# EAGLE board combined-v2 (EAGLE 9.6.2), part 1 of 2
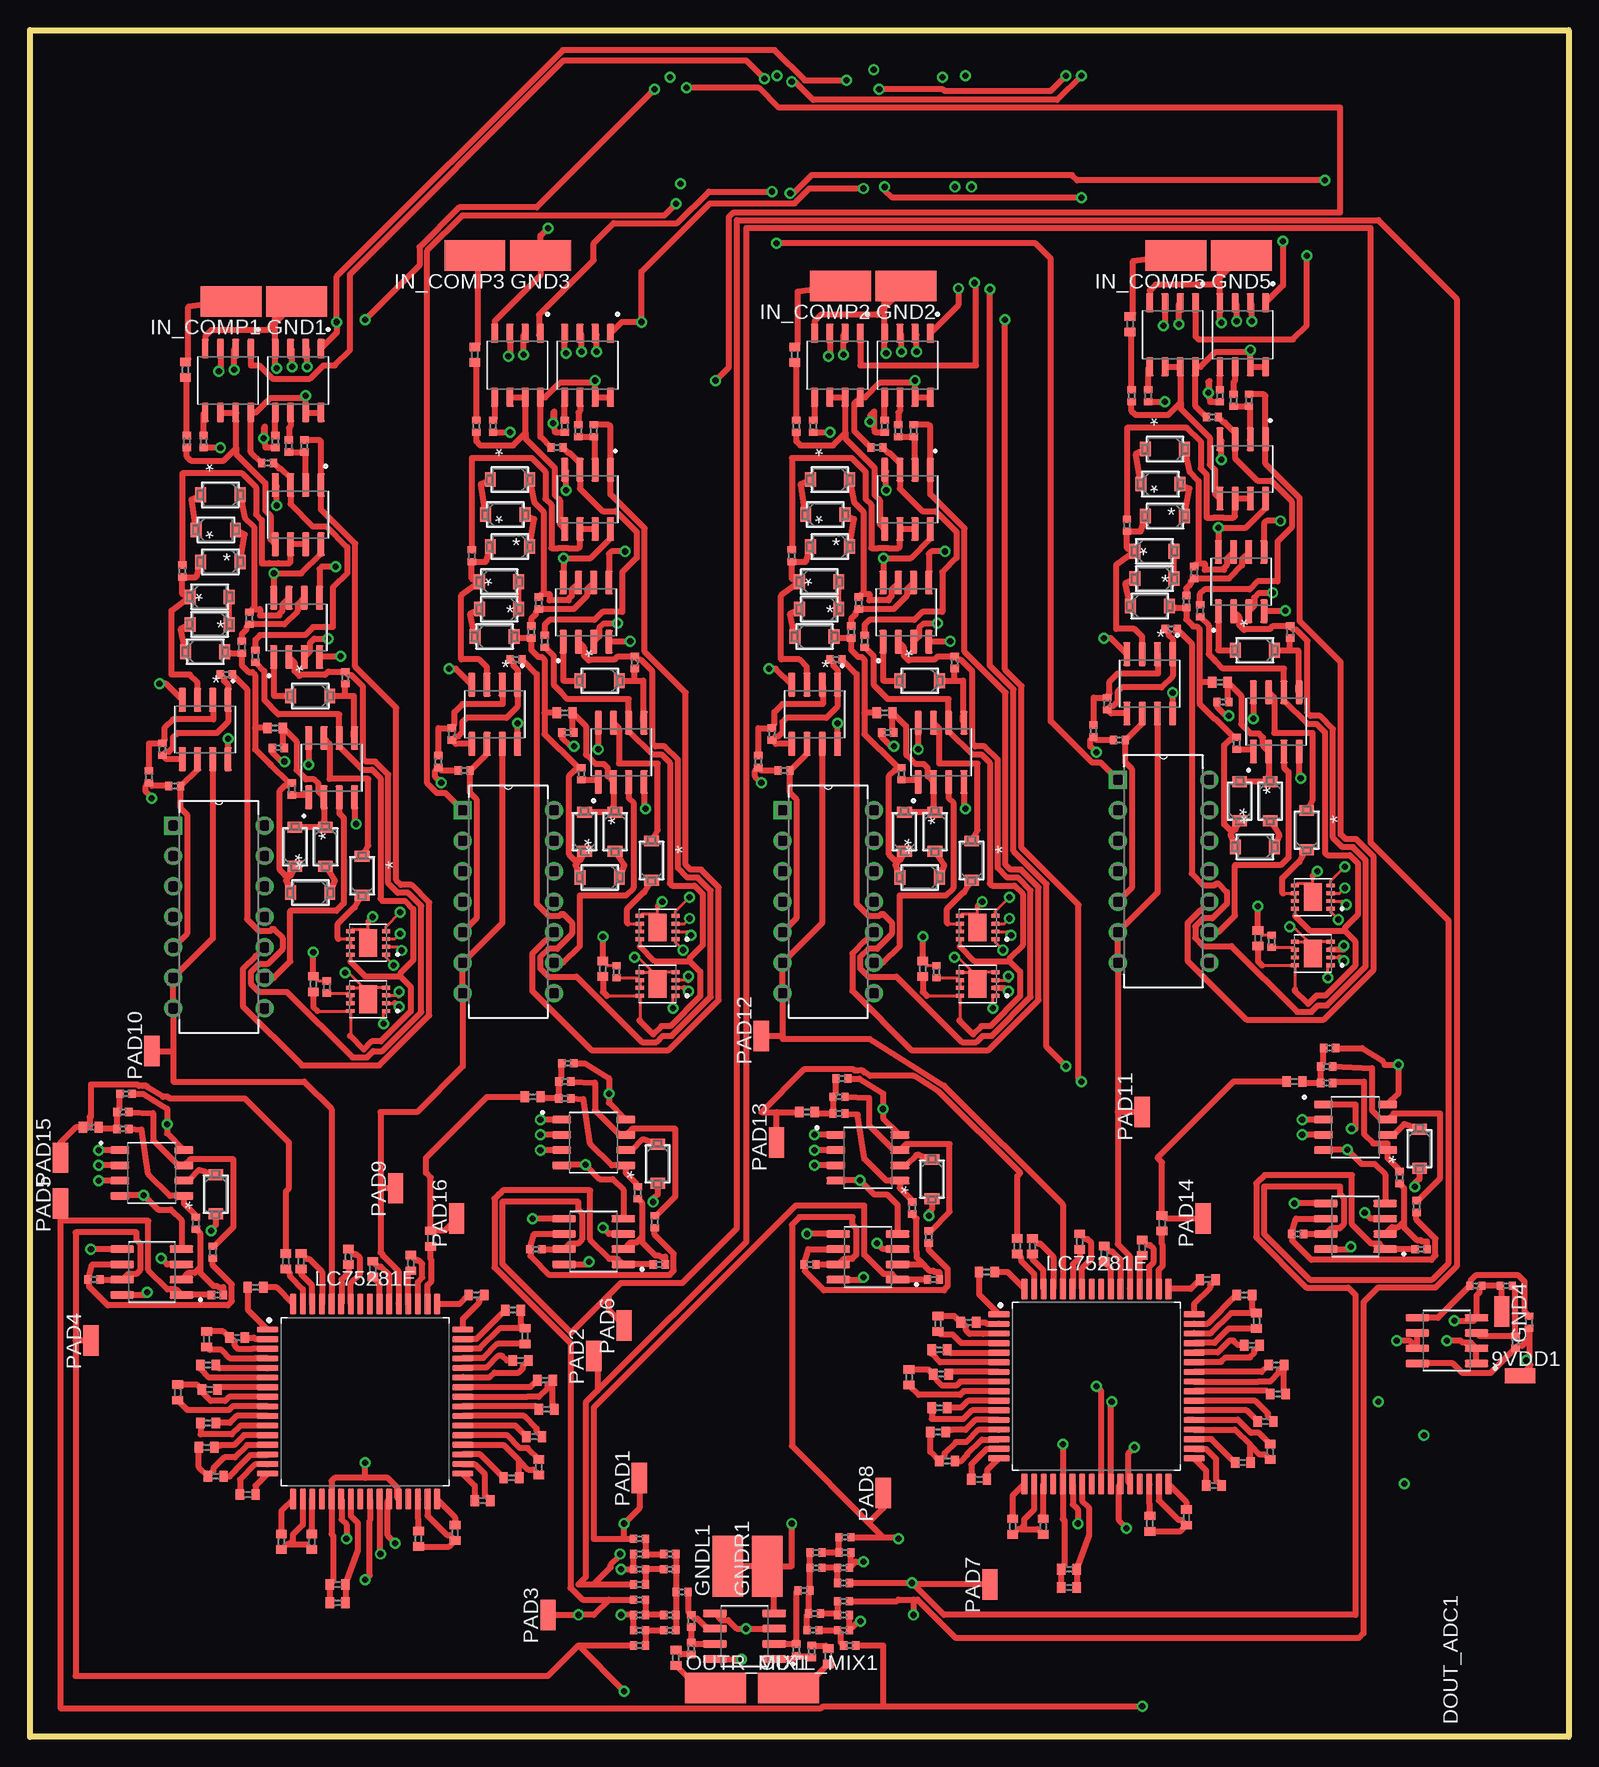
[diagram p6: board, top side]
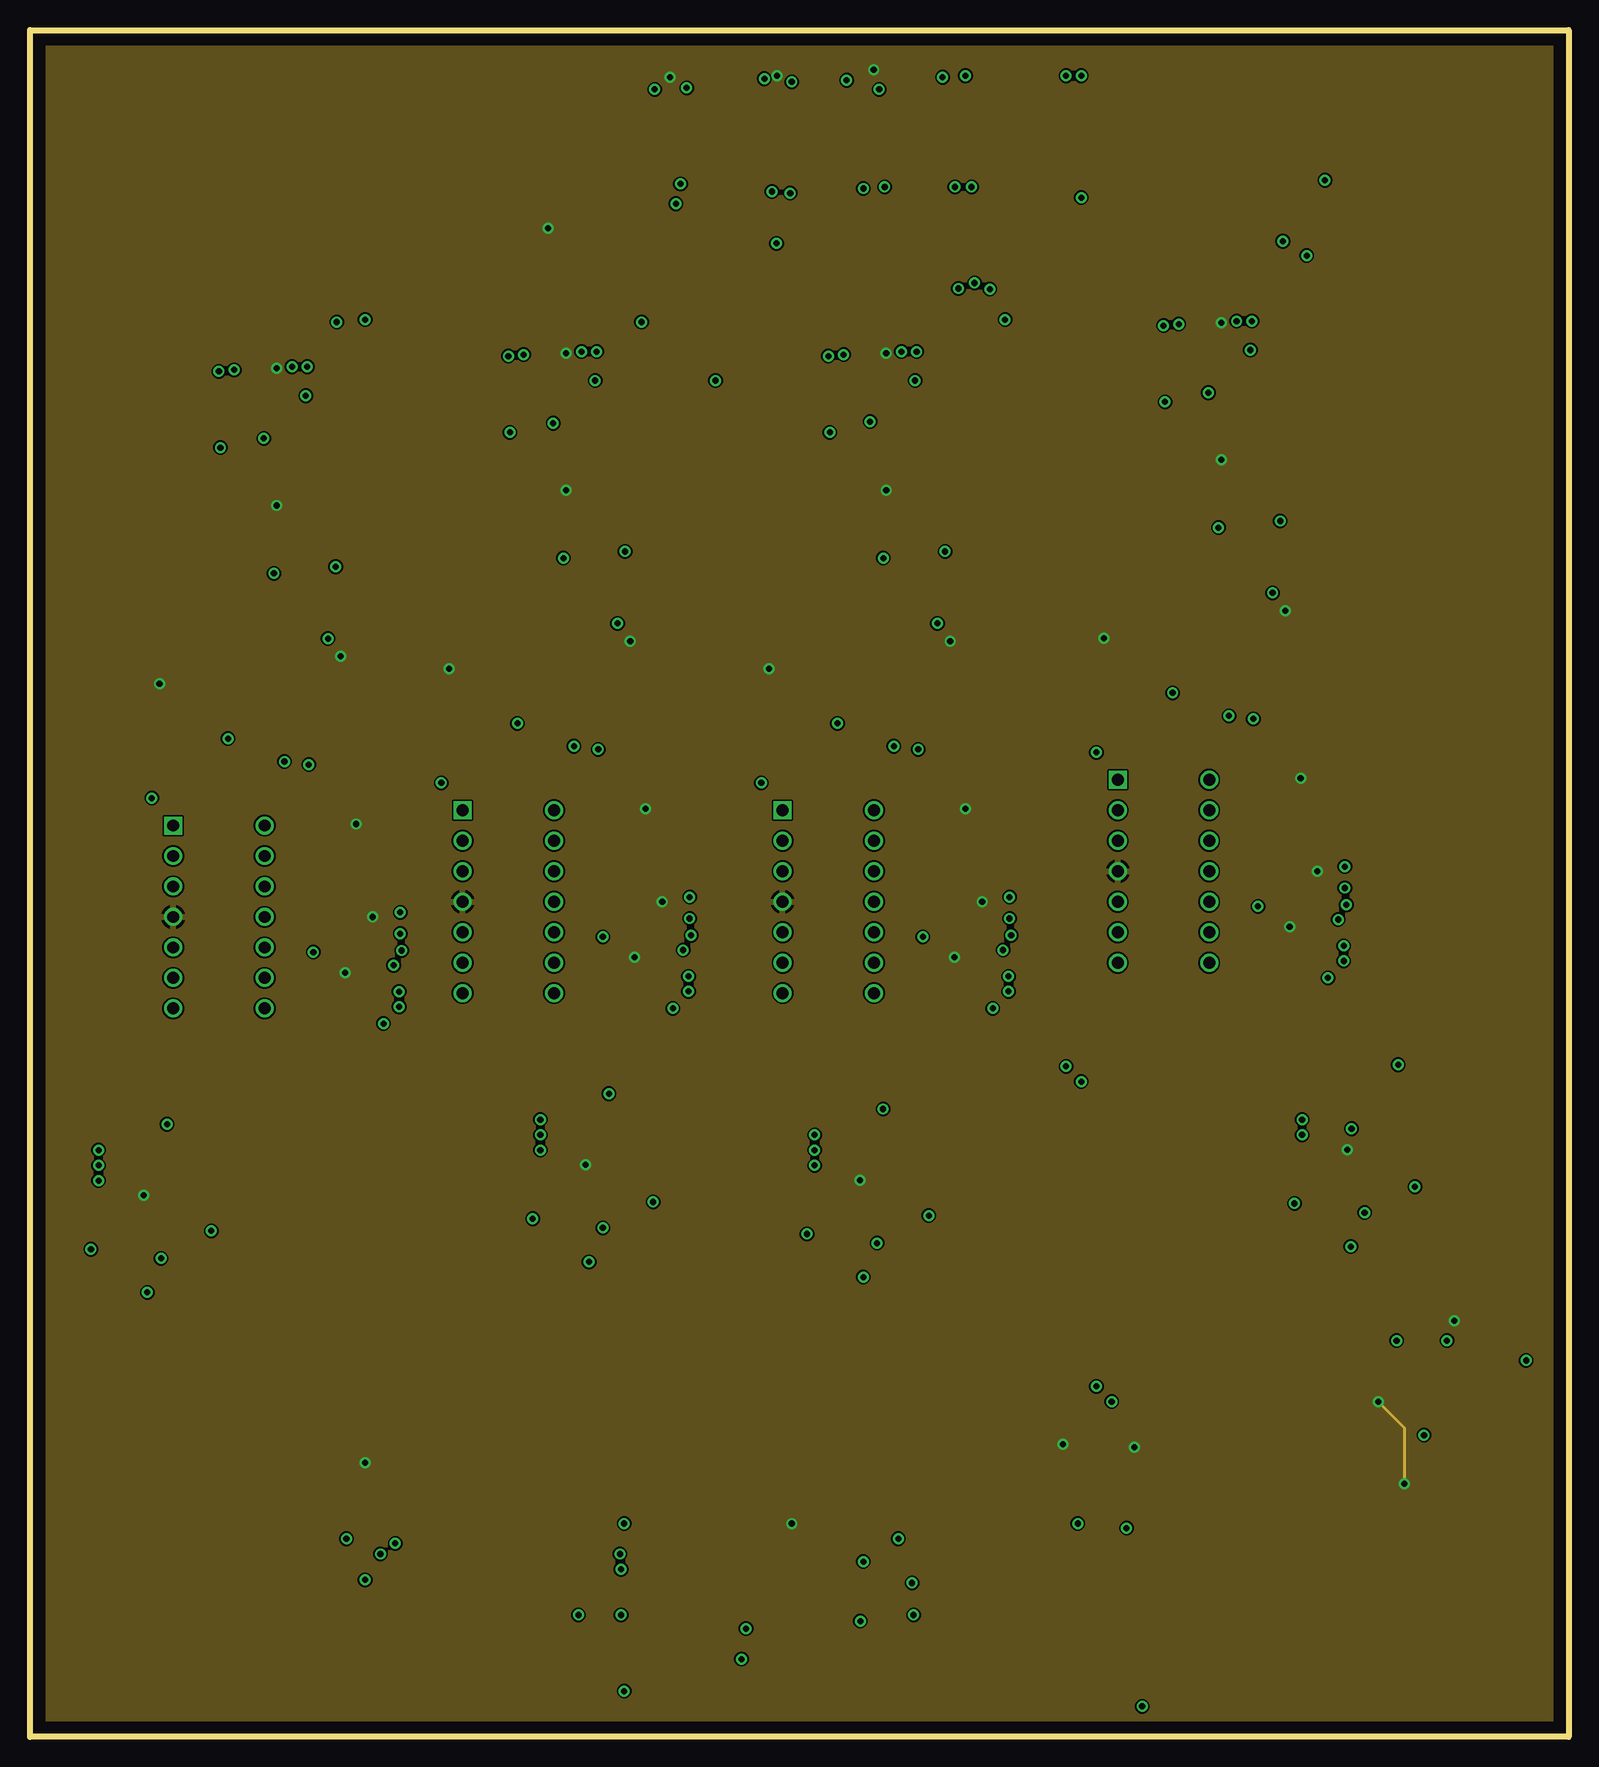
[diagram p7: board, inner layer Route2]
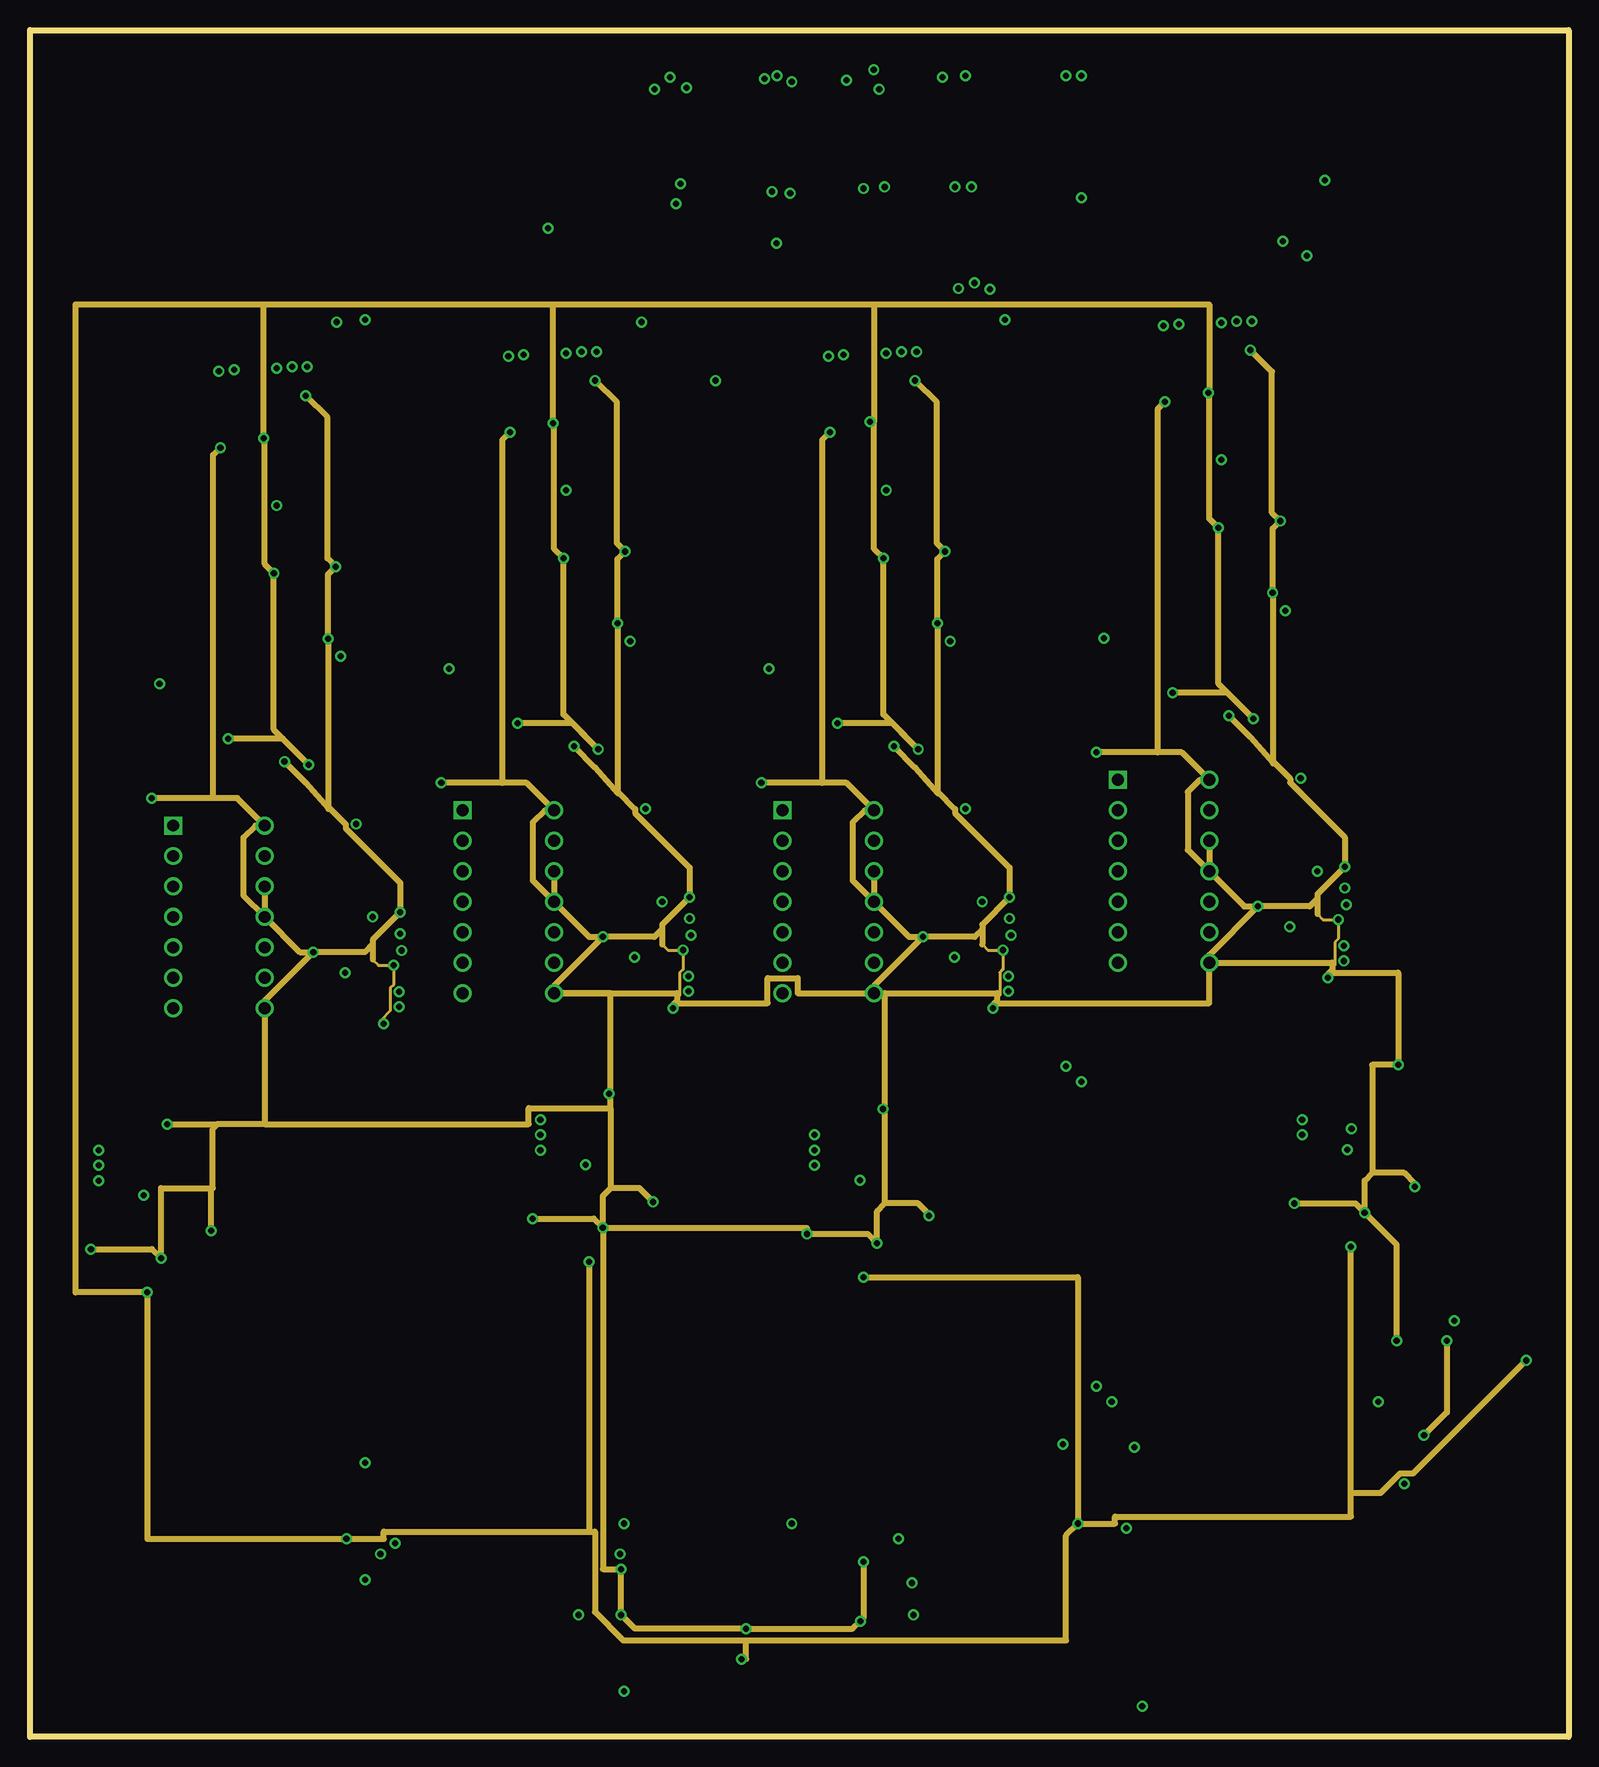
[diagram p8: board, inner layer Route15]
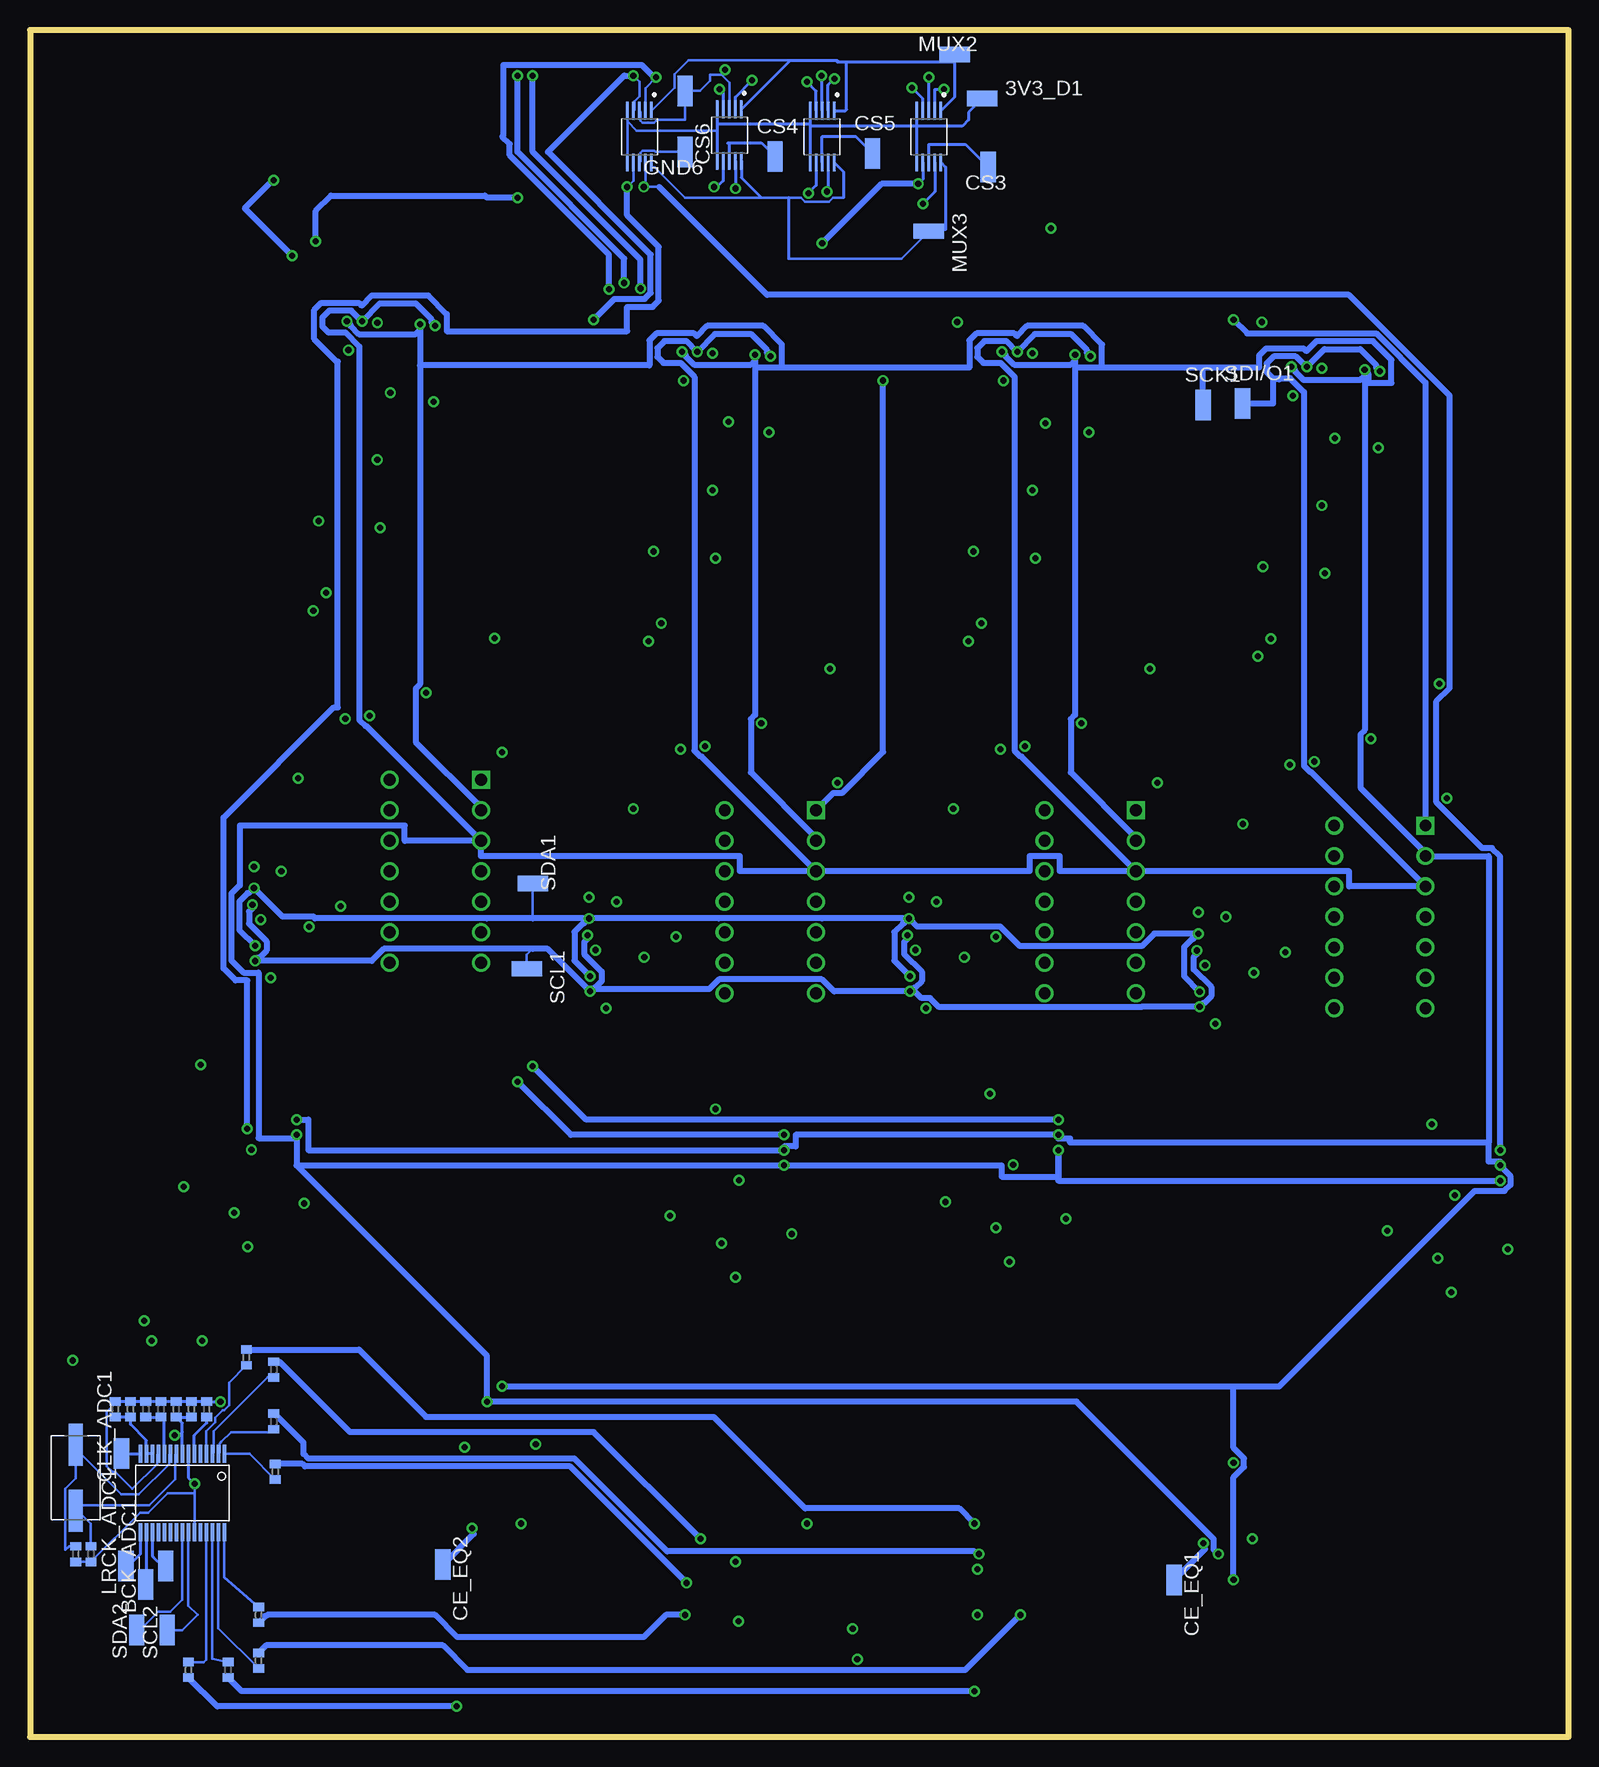
[diagram p9: board, bottom side, seen from below]

Size 128.27 x 142.24 mm. Coordinates in mm from the lower left corner, seen from the top.
Outline: 0,0 0,142.24 128.27,142.24 128.27,0 0,0
Copper layers (1+2*15+16): Top 0.035mm / dielectric 1.5mm / Route2 0.035mm / dielectric 0.15mm / Route15 0.035mm / dielectric 0.2mm / Bottom 0.035mm
Design rules "default *": minimum track width 6mil, minimum drill 0.35mm, track to track 6mil, track to pad 6mil, pad to pad 6mil, via to via 6mil, smd to smd 6mil, copper to edge 40mil, drill to drill 6mil, minimum pad ring 10mil, minimum via ring 8mil, stop-mask expansion 4mil, vias tented up to drill 0mil, thermal gap 10mil

## Footprints (pad centres in the part's own frame; a part is rotated, then mirrored left to right if it is on the bottom)
SMD1,27-2,54 = smd 1.27 x 2.54: 1 0,0
SOIC127P599X175-8N = smd 1.58 x 0.6: 1 -2.67,1.905; 2 -2.67,0.635; 3 -2.67,-0.635; 4 -2.67,-1.905; 5 2.67,-1.905; 6 2.67,-0.635; 7 2.67,0.635; 8 2.67,1.905
DIP254P762X432-14 = drill 0.991 square: 1 -7.62,15.24 | drill 0.991: 2 -7.62,12.7; 3 -7.62,10.16; 4 -7.62,7.62; 5 -7.62,5.08; 6 -7.62,2.54; 7 -7.62,0; 8 0,0; 9 0,2.54; 10 0,5.08; 11 0,7.62; 12 0,10.16; 13 0,12.7; 14 0,15.24
SON65P300X300X80-9N = smd 0.76 x 0.32: 1 -1.485,0.975; 2 -1.485,0.325; 3 -1.485,-0.325; 4 -1.485,-0.975; 5 1.485,-0.975; 6 1.485,-0.325; 7 1.485,0.325; 8 1.485,0.975 | smd 1.5 x 2.3: 9 0,0
C0402 = smd 0.7 x 0.9: 1 -0.65,0; 2 0.65,0
SOD123 = smd 0.91 x 1.22: 1 -1.63,0; 2 1.63,0
SMD2,54-5,08 = smd 2.54 x 5.08: 1 0,0
TSSOP-30 = smd 0.3 x 1.5: 1 -3.5,-3.27; 2 -3,-3.27; 3 -2.5,-3.27; 4 -2,-3.27; 5 -1.5,-3.27; 6 -1,-3.27; 7 -0.5,-3.27; 8 0,-3.27; 9 0.5,-3.27; 10 1,-3.27; 11 1.5,-3.27; 12 2,-3.27; 13 2.5,-3.27; 14 3,-3.27; 15 3.5,-3.27; 16 3.5,3.27; 17 3,3.27; 18 2.5,3.27; 19 2,3.27; 20 1.5,3.27; 21 1,3.27; 22 0.5,3.27; 23 0,3.27; 24 -0.5,3.27; 25 -1,3.27; 26 -1.5,3.27; 27 -2,3.27; 28 -2.5,3.27; 29 -3,3.27; 30 -3.5,3.27
SOIC127P599X175-8N' = smd 1.97 x 0.6: 1 -2.47,1.905; 2 -2.47,0.635; 3 -2.47,-0.635; 4 -2.47,-1.905; 5 2.47,-1.905; 6 2.47,-0.635; 7 2.47,0.635; 8 2.47,1.905
R0402 = smd 0.6 x 0.7: 1 -0.5,0; 2 0.5,0
SOP50P490X110-10N = smd 1.47 x 0.28: 1 -2.15,1; 2 -2.15,0.5; 3 -2.15,0; 4 -2.15,-0.5; 5 -2.15,-1; 6 2.15,-1; 7 2.15,-0.5; 8 2.15,0; 9 2.15,0.5; 10 2.15,1
QFP80P1720X1720X270-64N = smd 1.758 x 0.522: 1 -8.127,6; 2 -8.127,5.2; 3 -8.127,4.4; 4 -8.127,3.6; 5 -8.127,2.8; 6 -8.127,2; 7 -8.127,1.2; 8 -8.127,0.4; 9 -8.127,-0.4; 10 -8.127,-1.2; 11 -8.127,-2; 12 -8.127,-2.8; 13 -8.127,-3.6; 14 -8.127,-4.4; 15 -8.127,-5.2; 16 -8.127,-6; 33 8.127,-6; 34 8.127,-5.2; 35 8.127,-4.4; 36 8.127,-3.6; 37 8.127,-2.8; 38 8.127,-2; 39 8.127,-1.2; 40 8.127,-0.4; 41 8.127,0.4; 42 8.127,1.2; 43 8.127,2; 44 8.127,2.8; 45 8.127,3.6; 46 8.127,4.4; 47 8.127,5.2; 48 8.127,6 | smd 0.522 x 1.758: 17 -6,-8.127; 18 -5.2,-8.127; 19 -4.4,-8.127; 20 -3.6,-8.127; 21 -2.8,-8.127; 22 -2,-8.127; 23 -1.2,-8.127; 24 -0.4,-8.127; 25 0.4,-8.127; 26 1.2,-8.127; 27 2,-8.127; 28 2.8,-8.127; 29 3.6,-8.127; 30 4.4,-8.127; 31 5.2,-8.127; 32 6,-8.127; 49 6,8.127; 50 5.2,8.127; 51 4.4,8.127; 52 3.6,8.127; 53 2.8,8.127; 54 2,8.127; 55 1.2,8.127; 56 0.4,8.127; 57 -0.4,8.127; 58 -1.2,8.127; 59 -2,8.127; 60 -2.8,8.127; 61 -3.6,8.127; 62 -4.4,8.127; 63 -5.2,8.127; 64 -6,8.127
XTAL_ECS-245.7-20-3X-EN-TR = smd 3.5 x 1.2: 1 -2.75,0; 2 2.75,0

## Placement (x,y rotation side)
3V3_D1  [SMD1,27-2,54]  48.89,136.52 270 bottom
9VDD1  [SMD1,27-2,54]  124.21,30.1 270 top
10KPOT1_PAN1  MCP4131-503E/SN  [SOIC127P599X175-8N]  46.99,49.53 0 top
10KPOT1_PAN2  MCP4131-503E/SN  [SOIC127P599X175-8N]  69.85,48.26 0 top
10KPOT1_PAN3  MCP4131-503E/SN  [SOIC127P599X175-8N]  10.16,46.99 0 top
10KPOT1_PAN4  MCP4131-503E/SN  [SOIC127P599X175-8N]  110.49,50.8 0 top
10POT1_COMP1  MCP4131-503E/SN  [SOIC127P599X175-8N]  22.35,113.03 270 top
10POT1_COMP2  MCP4131-503E/SN  [SOIC127P599X175-8N]  73.15,114.3 270 top
10POT1_COMP3  MCP4131-503E/SN  [SOIC127P599X175-8N]  46.48,114.3 270 top
10POT1_COMP5  MCP4131-503E/SN  [SOIC127P599X175-8N]  101.09,116.84 270 top
10POT2_COMP1  MCP4131-503E/SN  [SOIC127P599X175-8N]  16.51,113.03 270 top
10POT2_COMP2  MCP4131-503E/SN  [SOIC127P599X175-8N]  67.31,114.3 270 top
10POT2_COMP3  MCP4131-503E/SN  [SOIC127P599X175-8N]  40.64,114.3 270 top
10POT2_COMP5  MCP4131-503E/SN  [SOIC127P599X175-8N]  95.25,116.84 270 top
100POT1_COMP1  MCP42100-I/P  [DIP254P762X432-14]  19.56,60.71 0 top
100POT1_COMP2  MCP42100-I/P  [DIP254P762X432-14]  70.36,61.98 0 top
100POT1_COMP3  MCP42100-I/P  [DIP254P762X432-14]  43.69,61.98 0 top
100POT1_COMP5  MCP42100-I/P  [DIP254P762X432-14]  98.3,64.52 0 top
200POT1_COMP1  MAX5419NETA+  [SON65P300X300X80-9N]  28.19,66.17 180 top
200POT1_COMP2  MAX5419META+  [SON65P300X300X80-9N]  78.99,67.44 180 top
200POT1_COMP3  MAX5419PETAT  [SON65P300X300X80-9N]  52.32,67.44 180 top
200POT1_COMP5  MAX5419LETA+  [SON65P300X300X80-9N]  106.93,69.98 180 top
200POT2_COMP1  MAX5419NETA+  [SON65P300X300X80-9N]  28.19,61.47 180 top
200POT2_COMP2  MAX5419META+  [SON65P300X300X80-9N]  78.99,62.74 180 top
200POT2_COMP3  MAX5419PETAT  [SON65P300X300X80-9N]  52.32,62.74 180 top
200POT2_COMP5  MAX5419LETA+  [SON65P300X300X80-9N]  106.93,65.28 180 top
BCK_ADC1  [SMD1,27-2,54]  118.62,12.7 0 bottom
C2  10uF  [C0402]  64.77,52.07 0 top
C3  0.1uF  [C0402]  66.55,6.73 270 top
C4  0.1uF  [C0402]  53.85,6.6 270 top
C5  10uF  [C0402]  105.41,54.61 0 top
C6  10uF  [C0402]  41.91,53.34 0 top
C7  0.047uF  [C0402]  18.8,37.46 0 top
C8  10uF  [C0402]  5.08,50.8 0 top
C9  0.047uF  [C0402]  17.27,33.27 180 top
C10  0.01uF  [C0402]  14.86,30.99 0 top
C11  0.01uF  [C0402]  14.99,28.96 180 top
C12  0.068uF  [C0402]  14.86,26.16 0 top
C13  0.068uF  [C0402]  14.73,24.13 180 top
C14  0.01uF  [C0402]  18.16,20.19 180 top
C15  0.01uF  [C0402]  20.96,16.26 270 top
C16  0.01uF  [C0402]  35.43,17.02 270 top
C17  0.01uF  [C0402]  37.72,19.68 0 top
C18  0.068uF  [C0402]  42.42,22.48 270 top
C19  0.068uF  [C0402]  42.04,25.02 0 top
C20  0.01uF  [C0402]  42.93,29.72 0 top
C21  0.01uF  [C0402]  40.89,31.37 180 top
C22  0.047uF  [C0402]  40.26,35.56 0 top
C23  0.047uF  [C0402]  37.21,36.83 180 top
C24  10uF  [C0402]  14.73,33.15 90 top
C25  10uF  [C0402]  12.32,28.7 90 top
C26  10uF  [C0402]  15.49,21.72 180 top
C27  10uF  [C0402]  23.5,16.26 270 top
C28  10uF  [C0402]  25.65,12.7 180 top
C29  10uF  [C0402]  32.39,16.51 270 top
C30  10uF  [C0402]  40.13,21.59 0 top
C31  10uF  [C0402]  43.05,27.3 0 top
C32  10uF  [C0402]  41.28,33.4 90 top
C33  0.1uF  [C0402]  33.4,41.53 90 top
C34  10uF  [C0402]  31.75,39.5 90 top
C35  10uF  [C0402]  28.58,38.99 90 top
C36  10uF  [C0402]  26.54,40.01 90 top
C37  10uF  [C0402]  22.61,39.62 90 top
C38  0.1uF  [C0402]  21.34,39.62 90 top
C39  10uF  [C0402]  25.65,11.18 180 top
C42  680pF  [C0402]  20.45,84.07 0 top
C43  10uF  [C0402]  12.95,113.92 90 top
C44  1.5uF  [C0402]  23.62,62.74 90 top
C45  680pF  [C0402]  71.25,85.34 0 top
C46  10uF  [C0402]  63.75,115.19 90 top
C47  1.5uF  [C0402]  74.42,64.01 90 top
C48  680pF  [C0402]  44.58,85.34 0 top
C49  10uF  [C0402]  37.08,115.19 90 top
C50  1.5uF  [C0402]  47.75,64.01 90 top
C54  680pF  [C0402]  99.19,87.88 0 top
C55  10uF  [C0402]  91.69,117.73 90 top
C56  1.5uF  [C0402]  102.36,66.55 90 top
C68  0.1uF  [C0402]  119.89,27.3 90 bottom
C69  10uF  [C0402]  121.16,27.3 90 bottom
C70  0.1uF  [C0402]  114.81,27.3 90 bottom
C71  10uF  [C0402]  116.08,27.3 90 bottom
C72  1uF  [C0402]  113.54,27.3 90 bottom
C73  0.1uF  [C0402]  117.35,27.3 90 bottom
C74  1uF  [C0402]  118.62,27.3 90 bottom
C75  15pF  [C0402]  123.19,15.24 270 bottom
C76  15pF  [C0402]  124.46,15.24 270 bottom
C77  10uF  [C0402]  107.95,26.29 270 bottom
C78  10uF  [C0402]  110.24,31.62 270 bottom
C79  10uF  [C0402]  109.22,6.35 270 bottom
C80  10uF  [C0402]  115.06,5.59 90 bottom
C81  10uF  [C0402]  107.95,30.61 270 bottom
C82  10uF  [C0402]  109.22,10.16 90 bottom
C83  10uF  [C0402]  111.76,5.59 90 bottom
C84  10uF  [C0402]  107.82,22.1 270 bottom
C103  0.047uF  [C0402]  79.76,38.73 0 top
C104  0.047uF  [C0402]  78.23,34.54 180 top
C105  0.01uF  [C0402]  75.82,32.26 0 top
C106  0.01uF  [C0402]  75.95,30.23 180 top
C107  0.068uF  [C0402]  75.82,27.43 0 top
C108  0.068uF  [C0402]  75.69,25.4 180 top
C109  0.01uF  [C0402]  79.12,21.46 180 top
C110  0.01uF  [C0402]  81.92,17.53 270 top
C111  0.01uF  [C0402]  96.39,18.29 270 top
C112  0.01uF  [C0402]  98.68,20.95 0 top
C113  0.068uF  [C0402]  103.38,23.75 270 top
C114  0.068uF  [C0402]  103,26.29 0 top
C115  0.01uF  [C0402]  103.89,30.99 0 top
C116  0.01uF  [C0402]  101.85,32.64 180 top
C117  0.047uF  [C0402]  101.22,36.83 0 top
C118  0.047uF  [C0402]  98.17,38.1 180 top
C119  10uF  [C0402]  75.69,34.42 90 top
C120  10uF  [C0402]  73.28,29.97 90 top
C121  10uF  [C0402]  76.45,22.99 180 top
C122  10uF  [C0402]  84.45,17.53 270 top
C123  10uF  [C0402]  86.61,13.97 180 top
C124  10uF  [C0402]  93.34,17.78 270 top
C125  10uF  [C0402]  101.09,22.86 0 top
C126  10uF  [C0402]  104.01,28.57 0 top
C127  10uF  [C0402]  102.23,34.67 90 top
C128  0.1uF  [C0402]  94.36,42.8 90 top
C129  10uF  [C0402]  92.71,40.77 90 top
C130  10uF  [C0402]  89.53,40.26 90 top
C131  10uF  [C0402]  87.5,41.27 90 top
C132  10uF  [C0402]  83.57,40.89 90 top
C133  0.1uF  [C0402]  82.3,40.89 90 top
C134  10uF  [C0402]  86.61,12.45 180 top
CE_EQ1  [SMD1,27-2,54]  32.89,13.08 180 bottom
CE_EQ2  [SMD1,27-2,54]  93.85,14.35 180 bottom
CLK_ADC1  [SMD1,27-2,54]  120.65,23.62 0 bottom
CS3  [SMD1,27-2,54]  48.39,130.81 180 bottom
CS4  [SMD1,27-2,54]  66.17,131.7 0 bottom
CS5  [SMD1,27-2,54]  58.04,131.95 0 bottom
CS6  [SMD1,27-2,54]  73.66,132.08 180 bottom
D2  1N4148W-TP  [SOD123]  52.32,47.75 270 top
D3  1N4148W-TP  [SOD123]  75.18,46.48 270 top
D4  1N4148W-TP  [SOD123]  15.49,45.21 270 top
D5  1N4148W-TP  [SOD123]  115.82,49.02 270 top
D16  1N4148W-TP  [SOD123]  24.64,74.17 270 top
D17  1N4148W-TP  [SOD123]  23.37,70.36 180 top
D18  1N4148W-TP  [SOD123]  22.1,74.17 90 top
D19  1N4148W-TP  [SOD123]  27.69,71.75 90 top
D20  1N4148W-TP  [SOD123]  15.88,103.5 180 top
D21  1N4148W-TP  [SOD123]  15.49,100.58 0 top
D22  1N4148W-TP  [SOD123]  15.88,97.92 180 top
D23  1N4148W-TP  [SOD123]  14.99,95 0 top
D24  1N4148W-TP  [SOD123]  14.99,92.71 180 top
D25  1N4148W-TP  [SOD123]  14.61,90.42 0 top
D26  1N4148W-TP  [SOD123]  23.37,86.74 180 top
D27  1N4148W-TP  [SOD123]  75.44,75.44 270 top
D28  1N4148W-TP  [SOD123]  74.17,71.63 180 top
D29  1N4148W-TP  [SOD123]  72.9,75.44 90 top
D30  1N4148W-TP  [SOD123]  78.49,73.03 90 top
D31  1N4148W-TP  [SOD123]  66.68,104.77 180 top
D32  1N4148W-TP  [SOD123]  66.29,101.85 0 top
D33  1N4148W-TP  [SOD123]  66.68,99.19 180 top
D34  1N4148W-TP  [SOD123]  65.79,96.27 0 top
D35  1N4148W-TP  [SOD123]  65.79,93.98 180 top
D36  1N4148W-TP  [SOD123]  65.41,91.69 0 top
D37  1N4148W-TP  [SOD123]  74.17,88.01 180 top
D38  1N4148W-TP  [SOD123]  48.77,75.44 270 top
D39  1N4148W-TP  [SOD123]  47.5,71.63 180 top
D40  1N4148W-TP  [SOD123]  46.23,75.44 90 top
D41  1N4148W-TP  [SOD123]  51.82,73.03 90 top
D42  1N4148W-TP  [SOD123]  40.01,104.77 180 top
D43  1N4148W-TP  [SOD123]  39.62,101.85 0 top
D44  1N4148W-TP  [SOD123]  40.01,99.19 180 top
D45  1N4148W-TP  [SOD123]  39.12,96.27 0 top
D46  1N4148W-TP  [SOD123]  39.12,93.98 180 top
D47  1N4148W-TP  [SOD123]  38.73,91.69 0 top
D48  1N4148W-TP  [SOD123]  47.5,88.01 180 top
D60  1N4148W-TP  [SOD123]  103.38,77.98 270 top
D61  1N4148W-TP  [SOD123]  102.11,74.17 180 top
D62  1N4148W-TP  [SOD123]  100.84,77.98 90 top
D63  1N4148W-TP  [SOD123]  106.43,75.56 90 top
D64  1N4148W-TP  [SOD123]  94.61,107.31 180 top
D65  1N4148W-TP  [SOD123]  94.23,104.39 0 top
D66  1N4148W-TP  [SOD123]  94.61,101.73 180 top
D67  1N4148W-TP  [SOD123]  93.73,98.81 0 top
D68  1N4148W-TP  [SOD123]  93.73,96.52 180 top
D69  1N4148W-TP  [SOD123]  93.34,94.23 0 top
D70  1N4148W-TP  [SOD123]  102.11,90.55 180 top
DOUT_ADC1  [SMD1,27-2,54]  116.97,14.22 0 bottom
GND1  [SMD2,54-5,08]  22.23,119.63 90 top
GND2  [SMD2,54-5,08]  73.03,120.9 90 top
GND3  [SMD2,54-5,08]  42.55,123.44 90 top
GND4  [SMD1,27-2,54]  122.68,35.43 180 top
GND5  [SMD2,54-5,08]  100.97,123.44 90 top
GND6  [SMD1,27-2,54]  73.66,137.16 180 bottom
GNDL1  [SMD2,54-5,08]  58.17,14.22 0 top
GNDR1  [SMD2,54-5,08]  61.47,14.22 0 top
IC2  PCM1865DBT  [TSSOP-30]  115.57,20.32 180 bottom
IN_COMP1  [SMD2,54-5,08]  16.76,119.63 90 top
IN_COMP2  [SMD2,54-5,08]  67.56,120.9 90 top
IN_COMP3  [SMD2,54-5,08]  37.08,123.44 90 top
IN_COMP5  [SMD2,54-5,08]  95.5,123.44 90 top
LRCK_ADC1  [SMD1,27-2,54]  120.27,14.22 0 bottom
MUX2  [SMD1,27-2,54]  51.18,140.21 270 bottom
MUX3  [SMD1,27-2,54]  53.34,125.48 270 bottom
OPAMP1_COMP1  LM4562MAX/NOPB  [SOIC127P599X175-8N']  25.15,80.77 90 top
OPAMP1_COMP2  LM4562MAX/NOPB  [SOIC127P599X175-8N']  75.95,82.04 90 top
OPAMP1_COMP3  LM4562MAX/NOPB  [SOIC127P599X175-8N']  49.28,82.04 90 top
OPAMP1_COMP5  LM4562MAX/NOPB  [SOIC127P599X175-8N']  103.89,84.58 90 top
OPAMP1_MIX1  LM4562MAX/NOPB  [SOIC127P599X175-8N']  59.56,8.38 180 top
OPAMP1_PAN1  LM4562MAX/NOPB  [SOIC127P599X175-8N']  46.99,41.27 180 top
OPAMP1_PAN2  LM4562MAX/NOPB  [SOIC127P599X175-8N']  69.85,40.01 180 top
OPAMP1_PAN3  LM4562MAX/NOPB  [SOIC127P599X175-8N']  10.16,38.73 180 top
OPAMP1_PAN4  LM4562MAX/NOPB  [SOIC127P599X175-8N']  110.49,42.54 180 top
OPAMP2_COMP1  LM4562MAX/NOPB  [SOIC127P599X175-8N']  22.35,101.85 270 top
OPAMP2_COMP2  LM4562MAX/NOPB  [SOIC127P599X175-8N']  73.15,103.12 270 top
OPAMP2_COMP3  LM4562MAX/NOPB  [SOIC127P599X175-8N']  46.48,103.12 270 top
OPAMP2_COMP5  LM4562MAX/NOPB  [SOIC127P599X175-8N']  101.09,105.66 270 top
OPAMP3_COMP1  LM4562MAX/NOPB  [SOIC127P599X175-8N']  22.23,92.46 90 top
OPAMP3_COMP2  LM4562MAX/NOPB  [SOIC127P599X175-8N']  73.03,93.73 90 top
OPAMP3_COMP3  LM4562MAX/NOPB  [SOIC127P599X175-8N']  46.36,93.73 90 top
OPAMP3_COMP5  LM4562MAX/NOPB  [SOIC127P599X175-8N']  100.97,96.27 90 top
OPAMP4_COMP1  LM4562MAX/NOPB  [SOIC127P599X175-8N']  14.61,83.95 270 top
OPAMP4_COMP2  LM4562MAX/NOPB  [SOIC127P599X175-8N']  65.41,85.22 270 top
OPAMP4_COMP3  LM4562MAX/NOPB  [SOIC127P599X175-8N']  38.73,85.22 270 top
OPAMP4_COMP5  LM4562MAX/NOPB  [SOIC127P599X175-8N']  93.34,87.76 270 top
OUTL_MIX1  [SMD2,54-5,08]  63.25,4.06 270 top
OUTR_MIX1  [SMD2,54-5,08]  57.15,4.06 270 top
PAD1  [SMD1,27-2,54]  50.8,21.59 0 top
PAD2  [SMD1,27-2,54]  46.99,31.75 0 top
PAD3  [SMD1,27-2,54]  43.18,10.16 0 top
PAD4  [SMD1,27-2,54]  5.08,33.02 0 top
PAD5  [SMD1,27-2,54]  2.54,44.45 0 top
PAD6  [SMD1,27-2,54]  49.53,34.29 0 top
PAD7  [SMD1,27-2,54]  80.01,12.7 0 top
PAD8  [SMD1,27-2,54]  71.12,20.32 0 top
PAD9  [SMD1,27-2,54]  30.48,45.72 0 top
PAD10  [SMD1,27-2,54]  10.16,57.15 0 top
PAD11  [SMD1,27-2,54]  92.71,52.07 0 top
PAD12  [SMD1,27-2,54]  60.96,58.42 0 top
PAD13  [SMD1,27-2,54]  62.23,49.53 0 top
PAD14  [SMD1,27-2,54]  97.79,43.18 0 top
PAD15  [SMD1,27-2,54]  2.54,48.26 0 top
PAD16  [SMD1,27-2,54]  35.56,43.18 0 top
R5  10k  [R0402]  120.52,37.59 180 top
R6  1M  [R0402]  67.69,54.86 180 top
R7  5k  [R0402]  67.44,53.34 180 top
R8  10k  [R0402]  124.97,34.54 90 top
R9  10k  [R0402]  123.06,37.59 0 top
R10  5k  [R0402]  67.44,51.94 180 top
R11  5k  [R0402]  73.53,44.07 90 top
R12  10k  [R0402]  65.02,39.37 180 top
R13  5k  [R0402]  74.93,41.66 270 top
R14  10k  [R0402]  75.31,38.1 180 top
R15  1M  [R0402]  108.33,57.4 180 top
R16  5k  [R0402]  108.08,55.88 180 top
R17  5k  [R0402]  108.08,54.48 180 top
R18  5k  [R0402]  114.17,46.61 90 top
R19  10k  [R0402]  105.66,41.91 180 top
R20  5k  [R0402]  115.57,44.2 270 top
R21  10k  [R0402]  115.95,40.64 180 top
R22  17k  [R0402]  123.83,32.89 90 top
R31  5k  [R0402]  68.33,7.62 180 top
R32  10k  [R0402]  65.53,15.37 180 top
R33  5k  [R0402]  67.82,11.3 180 top
R34  10k  [R0402]  65.53,14.1 180 top
R35  5k  [R0402]  67.94,15.37 180 top
R36  5k  [R0402]  67.82,14.1 0 top
R37  5k  [R0402]  67.82,10.16 0 top
R38  5k  [R0402]  67.82,8.89 0 top
R39  5k  [R0402]  67.94,16.64 180 top
R40  5k  [R0402]  67.82,12.83 180 top
R41  10k  [R0402]  65.41,10.29 180 top
R42  10k  [R0402]  65.28,8.89 180 top
R43  5k  [R0402]  64.52,12.19 180 top
R44  50k  [R0402]  63.88,7.24 270 top
R45  1k  [R0402]  65.15,7.11 90 top
R46  5k  [R0402]  50.8,16.51 0 top
R47  10k  [R0402]  53.34,8.89 0 top
R48  5k  [R0402]  50.8,12.7 0 top
R49  10k  [R0402]  53.34,10.16 0 top
R50  5k  [R0402]  50.8,8.89 0 top
R51  5k  [R0402]  50.8,10.16 180 top
R52  5k  [R0402]  50.8,13.97 180 top
R53  5k  [R0402]  50.8,15.24 180 top
R54  5k  [R0402]  50.8,7.62 0 top
R55  5k  [R0402]  50.8,11.43 0 top
R56  10k  [R0402]  53.34,13.97 0 top
R57  10k  [R0402]  53.34,15.24 0 top
R58  5k  [R0402]  54.36,12.06 0 top
R59  50k  [R0402]  55.12,9.65 270 top
R60  1k  [R0402]  55.12,7.37 270 top
R63  100k  [R0402]  20.7,82.42 0 top
R64  470k  [R0402]  19.81,106.17 0 top
R65  1k  [R0402]  21.84,78.99 270 top
R66  470k  [R0402]  18.8,90.04 90 top
R67  100k  [R0402]  21.59,107.57 270 top
R68  1M  [R0402]  44.83,56.13 180 top
R69  5k  [R0402]  44.58,54.61 180 top
R70  5k  [R0402]  44.58,53.21 180 top
R71  5k  [R0402]  50.67,45.34 90 top
R72  10k  [R0402]  42.16,40.64 180 top
R73  5k  [R0402]  52.07,42.93 270 top
R74  10k  [R0402]  52.45,39.37 180 top
R75  100k  [R0402]  22.86,107.57 90 top
R76  10k  [R0402]  20.45,107.95 90 top
R77  100k  [R0402]  26.29,88.26 270 top
R78  100k  [R0402]  16.38,88.52 0 top
R79  100k  [R0402]  11.05,82.3 90 top
R80  10k  [R0402]  9.91,80.01 90 top
R81  20k  [R0402]  12.07,79.25 0 top
R82  1M  [R0402]  8,53.59 180 top
R83  5k  [R0402]  7.75,52.07 180 top
R84  5k  [R0402]  7.75,50.67 180 top
R85  5k  [R0402]  13.84,42.8 90 top
R86  10k  [R0402]  5.33,38.1 180 top
R87  5k  [R0402]  15.24,40.39 270 top
R88  10k  [R0402]  15.62,36.83 180 top
R89  100k  [R0402]  17.65,90.8 270 top
R90  100k  [R0402]  18.29,93.22 270 top
R91  100k  [R0402]  13.08,107.95 90 top
R92  10k  [R0402]  14.48,107.95 270 top
R93  100k  [R0402]  12.7,97.16 90 top
R94  100k  [R0402]  24.77,62.48 270 top
R95  100k  [R0402]  71.5,83.69 0 top
R96  470k  [R0402]  70.61,107.44 0 top
R97  1k  [R0402]  72.64,80.26 270 top
R98  470k  [R0402]  69.6,91.31 90 top
R99  100k  [R0402]  72.39,108.84 270 top
R100  100k  [R0402]  73.66,108.84 90 top
R101  10k  [R0402]  71.25,109.22 90 top
R102  100k  [R0402]  77.09,89.53 270 top
R103  100k  [R0402]  67.18,89.79 0 top
R104  100k  [R0402]  61.85,83.57 90 top
R105  10k  [R0402]  60.71,81.28 90 top
R106  20k  [R0402]  62.87,80.52 0 top
R107  100k  [R0402]  68.45,92.07 270 top
R108  100k  [R0402]  69.09,94.49 270 top
R109  100k  [R0402]  63.88,109.22 90 top
R110  10k  [R0402]  65.28,109.22 270 top
R111  100k  [R0402]  63.5,98.42 90 top
R112  100k  [R0402]  75.56,63.75 270 top
R113  100k  [R0402]  44.83,83.69 0 top
R114  470k  [R0402]  43.94,107.44 0 top
R115  1k  [R0402]  45.97,80.26 270 top
R116  470k  [R0402]  42.93,91.31 90 top
R117  100k  [R0402]  45.72,108.84 270 top
R118  100k  [R0402]  46.99,108.84 90 top
R119  10k  [R0402]  44.58,109.22 90 top
R120  100k  [R0402]  50.42,89.53 270 top
R121  100k  [R0402]  40.51,89.79 0 top
R122  100k  [R0402]  35.18,83.57 90 top
R123  10k  [R0402]  34.04,81.28 90 top
R124  20k  [R0402]  36.2,80.52 0 top
R125  100k  [R0402]  41.78,92.07 270 top
R126  100k  [R0402]  42.42,94.49 270 top
R127  100k  [R0402]  37.21,109.22 90 top
R128  10k  [R0402]  38.61,109.22 270 top
R129  100k  [R0402]  36.83,98.42 90 top
R130  100k  [R0402]  48.89,63.75 270 top
R149  100k  [R0402]  99.44,86.23 0 top
R150  470k  [R0402]  98.55,109.98 0 top
R151  1k  [R0402]  100.58,82.8 270 top
R152  470k  [R0402]  97.54,93.85 90 top
R153  100k  [R0402]  100.33,111.38 270 top
R154  100k  [R0402]  101.6,111.38 90 top
R155  10k  [R0402]  99.19,111.76 90 top
R156  100k  [R0402]  105.03,92.07 270 top
R157  100k  [R0402]  95.12,92.33 0 top
R158  100k  [R0402]  89.79,86.11 90 top
R159  10k  [R0402]  88.65,83.82 90 top
R160  20k  [R0402]  90.81,83.06 0 top
R161  100k  [R0402]  96.39,94.61 270 top
R162  100k  [R0402]  97.03,97.03 270 top
R163  100k  [R0402]  91.82,111.76 90 top
R164  10k  [R0402]  93.22,111.76 270 top
R165  100k  [R0402]  91.44,100.97 90 top
R166  100k  [R0402]  103.5,66.29 270 top
SCK1  [SMD1,27-2,54]  30.48,111 0 bottom
SCL1  [SMD1,27-2,54]  86.87,64.01 270 bottom
SCL2  [SMD1,27-2,54]  116.84,8.89 0 bottom
SDA1  [SMD1,27-2,54]  86.36,71.12 270 bottom
SDA2  [SMD1,27-2,54]  119.38,8.89 0 bottom
SDI/O1  [SMD1,27-2,54]  27.18,111.12 0 bottom
U2  LM4562MAX/NOPB  [SOIC127P599X175-8N']  118.11,33.02 180 top
U3  TMUX1204DGSR  [SOP50P490X110-10N]  53.34,133.35 270 bottom
U4  TMUX1204DGSR  [SOP50P490X110-10N]  62.23,133.35 270 bottom
U5  TMUX1204DGSR  [SOP50P490X110-10N]  69.98,133.48 270 bottom
U11  TMUX1204DGSR  [SOP50P490X110-10N]  77.47,133.35 270 bottom
U$1  LC75281E  [QFP80P1720X1720X270-64N]  27.94,27.94 0 top
U$3  LC75281E  [QFP80P1720X1720X270-64N]  88.9,29.21 0 top
Y2  ECS-245.7-20-3X-EN-TR  [XTAL_ECS-245.7-20-3X-EN-TR]  124.46,21.59 270 bottom

## Tracks (layer width: path | path; a pad name or v marks a point on that pad's centre or on a via)
3V3A  (via drill 0.51)
  Top 0.508: U2.1 U2.2 120.12,32.85 119.43,32.85 119.26,33.02 v118.11,33.02
  Route15 0.508: v118.11,33.02 118.11,27.05 v116.2,25.15
  Bottom 0.254: IC2.8 115.57,25.4 | 115.57,25.4 115.57,26.15 C71.1 C70.1 | 115.57,25.4 115.82,25.15 v116.2,25.15
3V3D
  Bottom 0.254: IC2.13 IC2.14 118.57,24.72 119.89,26.04 C68.1 C69.1
+3V3
  Bottom 0.203: U11.6 78.47,134.62 | 78.47,134.62 U11.5 | 70.98,133.86 77.71,133.86 78.47,134.62
  Bottom 0.254: U5.6 70.98,133.86 70.98,134.37 | 70.98,134.37 U5.5 | U4.5 63.23,134.37 | 63.23,134.37 63.23,134.24 | 63.23,134.24 U4.6 | U3.6 54.34,134.24 | 54.34,134.24 U3.5 | 54.34,134.24 63.23,134.24 | 63.23,134.37 70.98,134.37 | 3V3_D1.1 50.04,135.38 50.04,134.75 50.55,134.24 54.34,134.24
BCK_ADC
  Bottom 0.254: IC2.17 118.57,14.14 118.57,12.75 BCK_ADC1.1
CLK_ADC
  Bottom 0.254: CLK_ADC1.1 120.62,23.59 IC2.15
CS
  Bottom 0.203: U11.8 77.36,131.31 77.36,132.02 77.19,132.19 76.25,132.19 76.14,132.08 CS6.1
CS0
  Bottom 0.254: U3.8 53.34,132.72 50.29,132.72 CS3.1
CS0_COMP1  (via drill 0.51)
  Top 0.508: v52.07,137.29 42.24,127.46 35.78,127.46 32.46,124.14 32.46,122.63 v27.94,118.11
  Bottom 0.254: U3.2 52.84,137.29 v52.07,137.29
  Bottom 0.508: v27.94,118.11 26.8,116.97 16.06,116.97 11.94,112.85 100POT1_COMP1.1
CS0_COMP2  (via drill 0.51)
  Top 0.508: v53.85,127.76 52.88,126.8 36.05,126.8 33.12,123.87 33.12,79.45 33.93,78.64 34.65,78.64 100POT1_COMP3.1
  Bottom 0.254: U3.9 52.84,128.77 v53.85,127.76
CS0_COMP3  (via drill 0.51)
  Top 0.508: v57.15,113.03 58.27,114.15 58.27,126.66 58.65,127.05 109.22,127.05 109.22,135.76 62.41,135.76 60.76,137.41 v54.74,137.41
  Bottom 0.254: U3.4 53.84,136.52 v54.74,137.41
  Bottom 0.508: v57.15,113.03 57.15,82.09 60.6,78.64 60.96,78.64 61.32,78.64 100POT1_COMP2.1
CS0_COMP4  (via drill 0.51)
  Top 0.508: 100POT1_COMP5.1 89.26,81.18 88.54,81.18 85.09,84.63 85.09,123.19 83.82,124.46 v62.23,124.46
  Bottom 0.254: U3.7 53.84,129.8 v54.23,129.41
  Bottom 0.508: v54.23,129.41 57.28,129.41 v62.23,124.46
CS1
  Bottom 0.254: U5.8 69.98,132.72 70.1,132.84 67.31,132.84 CS4.1
CS1_COMP1  (via drill 0.51)
  Top 0.508: 10POT1_COMP1.1 25.58,117.02 v25.58,117.9 25.58,121.71 44.42,140.56 62.08,140.56 64.59,138.05 v68.07,138.05
  Bottom 0.254: U5.2 69.48,136.64 v68.07,138.05
CS1_COMP2  (via drill 0.51)
  Top 0.508: 10POT1_COMP3.1 49.32,117.9 v50.97,117.9 50.97,122.09 56.67,127.79 63.73,127.79 64.97,129.03 v69.47,129.03
  Bottom 0.254: U5.9 v69.48,129.04 v69.47,129.03
CS1_COMP3  (via drill 0.51)
  Top 0.508: 10POT1_COMP2.1 77.39,119.3 v77.39,120.7 | v70.79,137.29 76.11,137.29 76.26,137.14 85.07,137.14 v86.36,138.43
  Bottom 0.254: U5.4 70.48,137.02 70.74,137.29 v70.79,137.29
  Bottom 0.508: v77.39,120.7 77.39,123.11 86.36,132.08 v86.36,138.43
CS1_COMP4  (via drill 0.51)
  Top 0.508: 10POT1_COMP5.1 104.44,120.95 v104.44,124.63 | v87.63,128.27 71.88,128.27 71.25,128.91 v71.25,129.16
  Bottom 0.254: U5.7 70.48,131.32 70.48,129.67 70.99,129.16 v71.25,129.16
  Bottom 0.508: v104.44,124.63 104.44,127.17 103.17,128.44 90.34,128.44 90.17,128.27 v87.63,128.27
CS2
  Bottom 0.254: U4.8 62.23,133.35 59.44,133.35 CS5.1
CS2_COMP1  (via drill 0.51)
  Top 0.508: 10POT2_COMP1.1 18.42,114.3 19.1,114.3 20.21,113.18 23.35,113.18 24.46,114.3 25.4,114.3 26.67,115.57 26.67,121.88 44.5,139.7 59.69,139.7 v61.21,138.18
  Bottom 0.254: U4.2 61.73,137.66 v61.21,138.18
CS2_COMP2  (via drill 0.51)
  Top 0.508: 10POT2_COMP3.1 42.42,116.84 42.42,118.49 46.99,123.06 46.99,124.46 48.67,126.14 53.95,126.14 56.59,128.78 v61.85,128.78
  Bottom 0.254: U4.9 61.73,128.9 v61.85,128.78
CS2_COMP3  (via drill 0.51)
  Top 0.508: 10POT2_COMP2.1 69.22,114.3 78.87,114.3 78.87,121.03 v78.74,121.16 | v63.5,137.92 63.79,137.92 65.29,136.42 85.62,136.42 v87.63,138.43
  Bottom 0.254: U4.4 62.73,137.15 v63.5,137.92
  Bottom 0.508: v78.74,121.16 78.74,123.19 87.63,132.08 v87.63,138.43
CS2_COMP4  (via drill 0.51)
  Top 0.508: v106.43,123.44 106.43,117.6 105.28,116.46 97.41,116.46 97.16,116.71 10POT2_COMP5.1 | v63.37,128.65 63.66,128.65 65.16,130.15 86.86,130.15 87.3,129.72 v107.95,129.72
  Bottom 0.254: U4.7 62.73,129.29 v63.37,128.65
  Bottom 0.508: v107.95,129.72 108.03,129.72 110.36,127.38 v106.43,123.44
CS_PAN1  (via drill 0.51)
  Top 0.508: 10KPOT1_PAN1.1 v42.55,51.43 | v80.01,120.65 80.01,89.27 81.99,87.29 81.99,73.81 84.73,71.07 84.73,57.51 v86.36,55.88
  Bottom 0.203: U11.2 76.97,137.41 v76.07,138.3
  Bottom 0.508: v42.55,51.43 81.92,51.43 v86.36,55.88 | v76.07,138.3 76.23,138.3 77.27,139.34 88.8,139.34 88.8,133.45 88.9,133.35 88.29,132.74 88.29,131.81 80.01,123.53 v80.01,120.65
CS_PAN2  (via drill 0.51)
  Top 0.508: 10KPOT1_PAN3.1 v5.72,48.9
  Bottom 0.203: U11.9 76.97,129.28 77.09,129.16 | 75.82,129.16 77.09,129.16 | 77.09,129.16 v77.1,129.16
  Bottom 0.508: v5.72,48.9 5.72,73.38 6.41,74.07 7.22,74.07 11.02,77.87 11.02,86.31 9.93,87.4 9.93,111.77 18.32,120.16 66.83,120.16 75.82,129.16
CS_PAN3  (via drill 0.51)
  Top 0.508: 10KPOT1_PAN2.1 v65.41,50.16 | v81.28,118.11 81.28,88.94 82.65,87.56 82.65,74.09 87.4,69.34 87.4,54.84 v87.63,54.61
  Bottom 0.203: U11.4 77.86,135.61 77.86,136.32 77.47,136.72 77.47,137.92 v77.98,138.43
  Bottom 0.508: v65.41,50.16 83.19,50.16 v87.63,54.61 | v81.28,118.11 79.56,119.83 77.03,119.83 76.53,120.34 76.53,123.52 85.09,132.08 78.74,138.43 v77.98,138.43
CS_PAN4  (via drill 0.51)
  Top 0.508: 10KPOT1_PAN4.1 110.49,52.7 110.49,50.67 v110.16,50.67
  Bottom 0.203: U11.7 77.97,129.67 v78.49,129.16
  Bottom 0.508: v110.16,50.67 110.16,63.03 111.14,63.03 112.14,64.04 112.14,76.61 102.95,85.8 102.62,85.8 102.62,114.6 102.69,114.6 104.57,116.48 104.57,118.92 103.98,119.51 100.84,119.51 100.61,119.28 99.77,120.12 95.07,120.12 93.52,118.57 93.52,117.14 78.49,117.14 78.49,119.17 76.37,119.17 75.87,119.68 75.87,124.18 78.49,126.8 v78.49,129.16
DOUT_ADC
  Bottom 0.254: IC2.18 118.07,15.07 117.98,14.99 117.22,14.22 DOUT_ADC1.1
EQ1_CE1  (via drill 0.51)
  Top 0.508: U$1.27 29.81,19.69 29.81,16.76 v30.45,16.13
  Bottom 0.508: v30.45,16.13 30.32,16.13 30.32,15.65 CE_EQ1.1
EQ2_CE3  (via drill 0.51)
  Top 0.508: U$3.27 90.77,20.96 90.77,18.03 v91.41,17.4
  Bottom 0.508: v91.41,17.4 91.28,17.4 91.28,16.92 CE_EQ2.1
GND  (via drill 0.51)
  Top 0.254: 200POT1_COMP1.9 28.19,67.31 | 28.19,67.31 28.19,67.94 | 200POT2_COMP1.9 27.6,62.07 27.6,62.64 | 27.6,62.64 26.39,63.85 | 200POT2_COMP1.4 27.79,62.44 | 27.79,62.44 27.6,62.64 | 200POT2_COMP1.5 27.79,62.44 | 200POT1_COMP1.5 26.88,67.31 28.19,67.31 | 200POT1_COMP3.9 52.32,68.58 | 52.32,68.58 52.32,69.22 | 200POT2_COMP3.9 51.73,63.34 51.73,63.91 | 51.73,63.91 50.52,65.12 | 200POT2_COMP3.4 51.92,63.71 | 51.92,63.71 51.73,63.91 | 200POT2_COMP3.5 51.92,63.71 | 200POT1_COMP3.5 51.01,68.58 52.32,68.58 | 200POT1_COMP2.9 78.99,68.58 | 78.99,68.58 78.99,69.22 | 200POT2_COMP2.9 78.4,63.34 78.4,63.91 | 78.4,63.91 77.19,65.12 | 200POT2_COMP2.4 78.59,63.71 | 78.59,63.71 78.4,63.91 | 200POT2_COMP2.5 78.59,63.71 | 200POT1_COMP2.5 77.68,68.58 78.99,68.58 | 200POT1_COMP5.9 106.93,71.12 | 106.93,71.12 106.93,71.75 | 200POT2_COMP5.9 106.34,65.88 106.34,66.45 | 106.34,66.45 105.12,67.66 | 200POT2_COMP5.4 106.53,66.25 | 106.53,66.25 106.34,66.45 | 200POT2_COMP5.5 106.53,66.25 | 200POT1_COMP5.5 105.62,71.12 106.93,71.12
  Top 0.508: OPAMP1_MIX1.4 62.03,13.66 GNDR1.1 | GNDR1.1 GNDL1.1 | OPAMP1_PAN1.4 49.46,45.6 48.58,46.48 47.5,46.48 v46.32,47.66 v46.31,47.66 44.36,47.66 10KPOT1_PAN1.4 | OPAMP1_PAN3.4 12.63,43.06 11.75,43.94 10.67,43.94 v9.49,45.12 v9.48,45.12 7.53,45.12 10KPOT1_PAN3.4 | OPAMP1_PAN2.4 72.32,44.33 71.44,45.21 70.36,45.21 v69.18,46.39 v69.17,46.39 67.22,46.39 10KPOT1_PAN2.4 | OPAMP1_PAN4.4 112.96,46.87 112.08,47.75 111,47.75 v109.82,48.93 v109.81,48.93 107.86,48.93 10KPOT1_PAN4.4 | U$1.28 30.61,19.95 30.61,20.8 29.82,21.59 27.94,21.59 | 27.94,21.59 25.4,21.59 25.14,21.33 U$1.21 25.14,16.89 25.27,16.76 25.27,13 C28.2 C39.2 | 27.94,21.59 v27.94,22.86 | U$3.28 91.57,21.22 91.57,23.65 v92.05,24.13 | v86.11,24.38 v86.1,24.38 U$3.21 86.1,18.16 86.23,18.03 86.23,14.27 C123.2 C134.2 | OPAMP2_COMP1.4 20.57,104.2 v20.57,102.62 | OPAMP4_COMP1.4 11.36,87.76 v10.8,87.76 | OPAMP3_COMP1.4 24.19,90.04 v25.91,90.04 | v27.18,76.07 27.05,76.2 OPAMP1_COMP1.4 | 10POT2_COMP1.4 14.61,116.72 15.11,117.22 19.81,117.22 GND1.1 20.56,118.75 20.45,118.86 10POT1_COMP1.4 20.45,114.17 v20.57,114.05 | 28.19,67.94 v28.58,68.33 | 26.39,63.85 26.26,63.73 v26.26,63.68 | OPAMP2_COMP3.4 44.7,105.47 v44.7,103.89 | OPAMP4_COMP3.4 35.49,89.03 v34.92,89.03 | OPAMP3_COMP3.4 48.32,91.31 v50.04,91.31 | v51.31,77.34 51.18,77.47 OPAMP1_COMP3.4 | 10POT2_COMP3.4 38.73,117.99 42.55,121.8 GND3.1 42.55,125.09 v43.18,125.73 | 10POT1_COMP3.4 44.58,115.44 v44.7,115.32 | 52.32,69.22 v52.7,69.6 | 50.52,65.12 50.39,65 v50.39,64.95 | OPAMP2_COMP2.4 71.37,105.47 v71.37,103.89 | OPAMP4_COMP2.4 62.16,89.03 v61.59,89.03 | OPAMP3_COMP2.4 74.99,91.31 v76.71,91.31
  Top 0.508: v77.98,77.34 77.85,77.47 OPAMP1_COMP2.4 | 10POT2_COMP2.4 65.41,117.99 65.91,118.49 70.61,118.49 GND2.1 71.36,120.02 71.25,120.13 10POT1_COMP2.4 71.25,115.44 v71.37,115.32 | 78.99,69.22 v79.38,69.6 | 77.19,65.12 77.06,65 v77.06,64.95 | OPAMP2_COMP5.4 99.31,108.01 v99.31,106.43 | OPAMP4_COMP5.4 90.1,91.57 v89.53,91.57 | OPAMP3_COMP5.4 102.93,93.85 v104.65,93.85 | v105.92,79.88 105.79,80.01 OPAMP1_COMP5.4 | 10POT2_COMP5.4 93.34,120.53 93.85,121.03 98.55,121.03 GND5.1 99.3,122.56 99.19,122.67 10POT1_COMP5.4 99.19,117.98 v99.31,117.86 | 106.93,71.75 v107.31,72.14 | 105.12,67.66 105,67.54 v105,67.49 | GNDR1.1 63.5,14.22 v63.5,17.78 | v118.75,34.67 120.33,34.67 U2.4 120.58,36.78 120.83,37.03 120.83,37.4 R5.1 R9.1 122.68,37.47 GND4.1
  Route2 0.254: v112.39,27.94 114.55,25.78 v114.55,21.08
  Bottom 0.203: U11.3 77.36,135.39 77.36,134.68 77.19,134.51 76.25,134.51 76.08,134.68 76.08,134.74 73.66,134.74 GND6.1 72.43,137.16 71.59,138 71.59,138.43 71.6,138.43 71.6,138.51 70.74,138.51 | 70.74,138.51 70.62,138.51 69.96,137.84 69.96,135.52 69.98,135.54 U5.3 | v70.33,138.91 70.74,138.51 | IC2.25 114.55,17.07 114.55,20.32 | 114.55,20.32 v114.55,21.08 | C76.2 C75.2 119.09,18.69 118.43,18.69 116.81,20.32 114.55,20.32 | IC2.12 117.67,23.49 117.67,22.73 119.73,20.67 121.16,22.1 121.39,22.1 121.86,22.57 121.86,27.11 121.16,27.81 C69.2
  Bottom 0.254: U3.3 v53.34,138.3 | U4.3 62.23,138.43 v62.28,138.43 | C69.2 C68.2 C74.2 C73.2 C71.2 C70.2 C72.2 113.52,27.94 v112.39,27.94 | v114.55,21.08 115.07,21.6 IC2.7
  Bottom 0.508: v70.33,138.91 | v70.33,138.91
  pour Route2: 0,0 0,142.24 128.27,142.24 128.27,0
H1_COMP1
  Top 0.254: 23.96,60.48 26.71,60.48 | 26.71,60.48 26.71,58.46 | 200POT2_COMP1.8 26.71,60.48 | 200POT1_COMP1.8 26.71,64.6
  Top 0.508: R66.1 19.52,88.82 19.52,86.42 20.07,85.88 20.07,85.85 20.7,85.22 25.78,85.22 OPAMP1_COMP1.6 25.78,82.55 27.73,80.61 28.51,80.61 29.21,79.91 29.21,69.85 29.39,69.67 31.26,69.67 31.95,68.98 31.95,64.72 30.87,63.63 30.87,63.37 | 26.71,58.46 26.67,58.42 27.81,57.28 28.5,57.96 29.25,57.96 31.73,60.45 31.73,62.5 30.87,63.37 | 26.71,64.6 27.94,63.37 30.87,63.37 | C44.1 23.62,60.82 23.96,60.48
H1_COMP2
  Top 0.254: 48.09,61.74 50.84,61.74 | 50.84,61.74 50.84,59.73 | 200POT2_COMP3.8 50.84,61.74 | 200POT1_COMP3.8 50.84,65.87
  Top 0.508: R116.1 43.65,90.09 43.65,87.69 44.2,87.15 44.2,87.12 44.83,86.49 49.91,86.49 OPAMP1_COMP3.6 49.91,83.82 51.86,81.88 52.64,81.88 53.34,81.18 53.34,71.12 53.52,70.94 55.39,70.94 56.08,70.25 56.08,65.99 55,64.9 55,64.64 | 50.84,59.73 50.8,59.69 51.94,58.55 52.63,59.23 53.38,59.23 55.87,61.72 55.87,63.77 55,64.64 | 50.84,65.87 52.07,64.64 55,64.64 | C50.1 47.75,62.09 48.09,61.74
H1_COMP3
  Top 0.254: 74.77,61.74 77.51,61.74 | 77.51,61.74 77.51,59.73 | 200POT2_COMP2.8 77.51,61.74 | 200POT1_COMP2.8 77.51,65.87
  Top 0.508: R98.1 70.32,90.09 70.32,87.69 70.87,87.15 70.87,87.12 71.5,86.49 76.58,86.49 OPAMP1_COMP2.6 76.58,83.82 78.53,81.88 79.31,81.88 80.01,81.18 80.01,71.12 80.19,70.94 82.06,70.94 82.75,70.25 82.75,65.99 81.66,64.9 81.66,64.64 | 77.51,59.73 77.47,59.69 78.61,58.55 79.3,59.23 80.05,59.23 82.53,61.72 82.53,63.77 81.66,64.64 | 77.51,65.87 78.74,64.64 81.66,64.64 | C47.1 74.42,62.09 74.77,61.74
H1_COMP4
  Top 0.254: 102.7,64.28 105.45,64.28 | 105.45,64.28 105.45,62.27 | 200POT2_COMP5.8 105.45,64.28 | 200POT1_COMP5.8 105.45,68.41
  Top 0.508: R152.1 98.26,92.63 98.26,90.23 98.81,89.69 98.81,89.66 99.44,89.03 104.52,89.03 OPAMP1_COMP5.6 104.52,86.36 106.47,84.42 107.25,84.42 107.95,83.72 107.95,73.66 108.13,73.48 110,73.48 110.69,72.79 110.69,68.53 109.61,67.44 109.61,67.18 | 105.45,62.27 105.41,62.23 106.55,61.09 107.24,61.77 107.99,61.77 110.47,64.26 110.47,66.31 109.61,67.18 | 105.45,68.41 106.68,67.18 109.61,67.18 | C56.1 102.36,64.63 102.7,64.28
IN_COMP1
  Top 0.508: C43.2 13.21,114.82 13.21,119.17 IN_COMP1.1
IN_COMP2
  Top 0.508: C49.2 37.34,116.09 37.34,123.41 IN_COMP3.1
IN_COMP3
  Top 0.508: C46.2 64.01,116.09 64.01,120.44 IN_COMP2.1
IN_COMP4
  Top 0.508: C55.2 91.95,118.63 91.95,122.98 IN_COMP5.1
L1_COMP1
  Top 0.254: 25.71,66.49 200POT1_COMP1.6 200POT1_COMP1.7
  Top 0.508: 25.71,66.49 25.65,66.55 25.65,67.76 27.01,69.12 27.08,69.12 D19.1
L1_COMP2
  Top 0.254: 49.84,67.76 200POT1_COMP3.6 200POT1_COMP3.7
  Top 0.508: 49.84,67.76 49.78,67.82 49.78,69.03 51.14,70.39 51.21,70.39 D41.1
L1_COMP3
  Top 0.254: 76.51,67.76 200POT1_COMP2.6 200POT1_COMP2.7
  Top 0.508: 76.51,67.76 76.45,67.82 76.45,69.03 77.81,70.39 77.88,70.39 D30.1
L1_COMP4
  Top 0.254: 104.45,70.3 200POT1_COMP5.6 200POT1_COMP5.7
  Top 0.508: 104.45,70.3 104.39,70.36 104.39,71.57 105.75,72.93 105.82,72.93 D63.1
L2_COMP1
  Top 0.254: R94.2 26.52,61.98 200POT2_COMP1.6 200POT2_COMP1.7
L2_COMP2
  Top 0.254: R130.2 50.65,63.25 200POT2_COMP3.6 200POT2_COMP3.7
L2_COMP3
  Top 0.254: R112.2 77.32,63.25 200POT2_COMP2.6 200POT2_COMP2.7
L2_COMP4
  Top 0.254: R166.2 105.26,65.79 200POT2_COMP5.6 200POT2_COMP5.7
LRCK_ADC
  Bottom 0.254: IC2.16 119.07,15.24 120.09,14.22 LRCK_ADC1.1
MUX0
  Bottom 0.203: U11.1 74.55,137.42 74.55,138.53 73.37,139.71 64.89,139.71
  Bottom 0.254: U3.1 51.18,136.66 MUX2.1 51.18,139.58 60.2,139.58 | 60.2,139.58 60.2,135.63 60.33,135.5 U4.1 | U5.1 64.89,139.71 60.96,139.71 60.96,139.58 60.2,139.58
MUX1
  Bottom 0.203: MUX3.1 55.63,123.19 65.04,123.19 | 60.47,128.27 61.35,128.27 61.68,127.94 63.67,127.94 64,128.27 65.04,128.27 67.31,128.27 73.66,128.27 76.2,130.81 76.47,130.81 U11.10
  Bottom 0.254: U5.10 68.98,129.94 67.31,128.27 | U3.10 51.94,130.8 51.94,125.6 53.21,125.6 53.23,125.62 53.34,125.51 MUX3.1 | U4.10 60.47,130.44 60.47,128.27 | 65.04,128.27 65.04,123.19
N$2
  Top 0.508: R6.2 67.19,54.72 67.13,54.66 67.13,53.53 R7.2 R10.2 65.55,51.94 C2.2
N$3
  Top 0.508: R15.2 107.83,57.26 107.77,57.2 107.77,56.07 R16.2 R17.2 106.19,54.48 C5.2
N$4
  Top 0.508: C7.1 18.15,35.61 U$1.1
N$5
  Top 0.508: C10.1 14.21,30.64 14.91,29.94 U$1.6
N$6
  Top 0.508: C11.1 15.82,29.14 U$1.7
N$7
  Top 0.508: U$1.11 17.57,25.94 16.83,25.2 14.21,25.2 C12.1
N$8
  Top 0.508: R45.2 66.32,7.61 C3.1
N$9
  Top 0.508: R39.2 R35.2 R32.1
N$10
  Top 0.508: R42.2 64.78,10.16 R41.2 64.91,12.08 R43.1 65.02,14.08 R34.2 R32.2
N$11
  Top 0.508: R42.1 R38.1 67.57,8.64 67.57,7.87 R31.2
N$12
  Top 0.508: R33.2 R37.1 67.19,10.29 R41.1
N$13
  Top 0.508: U$1.12 17.85,25.14 17.02,24.32 15.86,24.32 C13.1
N$14
  Top 0.508: U$1.16 18.81,20.94 C14.1
N$15
  Top 0.508: U$1.17 20.96,18.83 C15.1
N$16
  Top 0.508: U$1.32 35.43,18.32 C16.1
N$17
  Top 0.508: U$1.33 37.07,20.94 C17.1
N$18
  Top 0.508: R40.2 R36.1 R34.1
N$19
  Top 0.508: R60.2 54.24,6.87 C4.1
N$20
  Top 0.508: R54.2 R50.2 R47.1
N$21
  Top 0.508: R57.2 R56.2 53.84,12.08 R58.1 53.86,10.18 R49.2 R47.2
N$22
  Top 0.508: R46.2 R53.1 R57.1
N$23
  Top 0.508: R48.2 R52.1 R56.1
N$24
  Top 0.508: R55.2 R51.1 R49.1
N$25
  Top 0.508: C18.1 41.49,24.06 40.83,24.06 39.72,25.17 35.56,25.17 35.59,25.14 U$1.37
N$26
  Top 0.508: R68.2 44.33,55.99 44.27,55.93 44.27,54.8 R69.2 R70.2 42.69,53.21 C6.2
N$27
  Top 0.508: C19.1 40.47,25.94 U$1.38
N$28
  Top 0.508: R82.2 7.5,53.45 7.44,53.39 7.44,52.26 R83.2 R84.2 5.86,50.67 C8.2
N$29
  Top 0.508: C20.1 41.7,29.14 U$1.42
N$30
  Top 0.508: U$1.43 36.1,29.97 38.33,29.97 38.71,30.35 40.75,30.35 41.1,30.71 41.1,30.93 C21.1
N$31
  Top 0.508: C22.1 37.22,33.17 36.1,33.17 U$1.47
N$32
  Top 0.508: C23.1 37.42,36.39 37.42,36.17 36.07,34.82 U$1.48
N$33
  Top 0.508: U$1.64 20.54,37.46 C7.2
N$34
  Top 0.508: U$1.3 18.51,32.34 18.48,32.32 17.36,32.32 17.06,32.61 17.06,32.96 16.75,33.27 C9.2 16.1,33.8 C24.2
N$35
  Top 0.508: C24.1 14.99,32.24 15.98,32.24 16.67,31.55 18.8,31.55 18.81,31.54 U$1.4
N$36
  Top 0.508: U$1.9 16.88,27.54 16.57,27.24 13.14,27.24 C25.1
N$37
  Top 0.508: C26.1 16.65,21.72 17.16,22.23 17.12,22.23 18.4,23.51 19.78,23.51 U$1.14
N$38
  Top 0.508: C27.1 23.5,17.35 23.51,17.36 23.51,19.78 U$1.19
N$39
  Top 0.508: U$1.23 26.74,18.42 27.34,17.81 27.34,15.55 C28.1 C39.1
N$40
  Top 0.508: C29.1 32.39,18.12 32.37,18.13 32.37,19.78 U$1.30
N$41
  Top 0.508: C30.1 37.53,23.54 U$1.35
N$42
  Top 0.508: C31.1 42.14,27.57 36.1,27.57 U$1.40
N$43
  Top 0.508: C32.1 38.95,32.75 37.78,31.57 36.1,31.57 U$1.45
N$44
  Top 0.508: U$1.50 33.14,37.64 33.47,37.97 33.47,39.72 33.4,39.79 C33.1
N$45
  Top 0.508: U$1.52 31.54,38.64 C34.1
N$46
  Top 0.508: U$1.55 29.14,37.77 C35.1
N$47
  Top 0.508: U$1.59 25.97,36.1 25.97,38.11 26.54,38.68 C36.1
N$48
  Top 0.508: U$1.62 23.51,36.1 23.51,37.63 22.61,38.53 C37.1
N$49
  Top 0.508: C38.1 21.65,38.66 21.65,38.41 22.74,37.32 U$1.63
N$50
  Top 0.508: U$1.5 19.78,30.71 15.79,30.71 C10.2
N$51
  Top 0.508: U$1.8 16.6,28.34 16.26,28 15.08,28 14.23,28.85 C11.2 13.96,29.34 12.33,29.34 C25.2
N$52
  Top 0.508: U$1.10 17.23,26.74 16.65,26.16 C12.2
N$53
  Top 0.508: U$1.13 19.78,24.31 18.09,24.31 17.08,23.3 16.21,23.3 15.29,22.38 15.29,22.16 C26.2 14.08,22.48 C13.2
N$54
  Top 0.508: U$1.15 19.78,22.71 18.79,22.71 17.51,21.43 C14.2
N$55
  Top 0.508: U$1.18 22.74,17.67 21.91,16.84 21.91,16.35 21.62,16.05 | 21.62,16.05 21.4,16.05 C15.2 | 21.62,16.05 23.05,16.05 C27.2
N$56
  Top 0.508: U$1.31 33.14,18.44 34.77,16.81 34.99,16.81 C16.2 34.92,15.86 C29.2
N$57
  Top 0.508: C17.2 37.93,20.13 37.93,21.88 37.09,22.71 36.89,22.71 36.1,22.71 U$1.34
N$58
  Top 0.508: U$1.36 39.47,24.34 40.8,23.01 | C18.2 41.98,22.27 41.54,22.27 40.8,23.01 | C30.2 40.78,23 40.8,23.01
N$59
  Top 0.508: C19.2 42.25,25.46 42.25,25.68 41.18,26.74 U$1.39
N$60
  Top 0.508: U$1.41 41.42,28.34 42.42,28.34 43.13,29.06 43.13,29.28 C20.2 43.58,27.43 C31.2
N$61
  Top 0.508: C21.2 39.75,31.37 39.37,31.75 39.03,31.75 38.05,30.77 36.1,30.77 U$1.44
N$62
  Top 0.508: C22.2 40.91,34.42 C32.2 39.18,34.05 37.5,32.37 36.1,32.37 U$1.46
N$63
  Top 0.508: C23.2 35.8,36.07 U$1.49
N$64
  Top 0.508: C34.2 32.19,39.7 32.41,39.7 32.71,39.41 32.71,38.29 32.34,37.92 U$1.51
N$65
  Top 0.508: C35.2 29.02,39.2 29.23,39.2 29.94,38.49 U$1.54
N$66
  Top 0.508: C36.2 26.98,40.21 27.2,40.21 27.5,39.91 27.5,38.56 26.74,37.8 U$1.58
N$67
  Top 0.508: C37.2 23.05,39.83 23.27,39.83 24.34,38.76 U$1.61
N$68
  Top 0.508: C9.1 18.68,33.27 18.79,33.17 19.78,33.17 U$1.2
N$70
  Top 0.508: R9.2 123.83,37.33 R22.2 120.84,33.39 U2.3
N$71
  Top 0.508: U2.5 117.36,34.93 R5.2 120.07,37.64 120.07,38.01 120.51,38.45 124.07,38.45 124.59,37.94 124.59,35.43 R8.2
N$74
  Top 0.508: D16.2 25.4,71.37 D17.1
N$75
  Top 0.508: D22.1 17.91,100.2 D21.2
N$76
  Top 0.508: D21.1 13.46,103.12 D20.2
N$77
  Top 0.508: R91.2 13.08,113.14 C43.1
N$78
  Top 0.508: D25.1 12.57,92.33 D24.2
N$79
  Top 0.508: D24.1 D23.2
N$80
  Top 0.508: D27.2 76.2,72.64 D28.1
N$81
  Top 0.508: D33.1 68.71,101.47 D32.2
N$82
  Top 0.508: D32.1 64.26,104.39 D31.2
N$83
  Top 0.508: R109.2 63.88,114.41 C46.1
N$84
  Top 0.508: D36.1 63.37,93.6 D35.2
N$85
  Top 0.508: D35.1 D34.2
N$86
  Top 0.508: D38.2 49.53,72.64 D39.1
N$87
  Top 0.508: D44.1 42.04,101.47 D43.2
N$88
  Top 0.508: D43.1 37.59,104.39 D42.2
N$89
  Top 0.508: R127.2 37.21,114.41 C49.1
N$90
  Top 0.508: D47.1 36.7,93.6 D46.2
N$91
  Top 0.508: D46.1 D45.2
N$98
  Top 0.508: D60.2 104.14,75.18 D61.1
N$99
  Top 0.508: D66.1 96.65,104.01 D65.2
N$100
  Top 0.508: D65.1 92.2,106.93 D64.2
N$101
  Top 0.508: R163.2 91.82,116.95 C55.1
N$102
  Top 0.508: D69.1 91.31,96.14 D68.2
N$103
  Top 0.508: D68.1 D67.2
N$114
  Bottom 0.254: IC2.6 114.57,25.13 113.54,26.16 C72.1
N$115
  Bottom 0.254: IC2.11 117.07,26.38 C73.1 C74.1
N$116
  Bottom 0.203: IC2.9 116.17,23.49 116.17,21.46 118.34,19.29 124.02,19.29 124.36,18.95 | 124.36,18.95 Y2.2 | C75.1 123.19,17.78 124.36,18.95
N$117
  Bottom 0.203: IC2.10 116.67,23.49 116.67,22.73 119.2,20.2 120.65,20.2 124.46,24.01 Y2.1 124.46,21.55 125.31,20.7 125.31,15.59 125.01,15.89 C76.1
N$118
  Bottom 0.203: IC2.1 109.97,23.59 C84.2
N$119
  Bottom 0.203: C77.2 108.19,25.4 111.52,25.4 112.32,24.59 112.33,24.59 112.47,24.45 112.47,23.69 IC2.2
N$120
  Top 0.508: C103.1 79.11,36.88 U$3.1
N$121
  Top 0.508: C105.1 75.17,31.91 75.87,31.21 U$3.6
N$122
  Top 0.508: C106.1 76.78,30.41 U$3.7
N$123
  Bottom 0.203: IC2.3 112.97,23.69 112.97,25.46 108.48,29.96 C81.2
N$124
  Top 0.508: U$3.11 78.53,27.21 77.79,26.47 75.17,26.47 C107.1
N$125
  Bottom 0.203: IC2.4 113.57,25.46 112.83,26.2 112.83,26.6 112.2,27.23 112.1,27.23 111.68,27.65 111.68,29.52 C78.2
N$126
  Bottom 0.203: C79.2 112.57,9.05 IC2.29
N$127
  Bottom 0.203: C83.2 113.07,6.5 IC2.28
N$128
  Bottom 0.203: C80.2 113.78,6.24 113.57,6.45 IC2.27
N$131
  Top 0.508: U$3.12 78.81,26.41 77.98,25.59 76.82,25.59 C108.1
N$132
  Top 0.508: U$3.16 79.77,22.21 C109.1
N$135
  Top 0.508: U$3.17 81.92,20.1 C110.1
N$136
  Top 0.508: U$3.32 96.39,19.59 C111.1
N$137
  Top 0.508: U$3.33 98.03,22.21 C112.1
N$138
  Top 0.508: C113.1 102.45,25.33 101.79,25.33 100.68,26.44 96.52,26.44 96.55,26.41 U$3.37
N$139
  Top 0.508: C114.1 101.43,27.21 U$3.38
N$140
  Top 0.508: C115.1 102.66,30.41 U$3.42
N$141
  Top 0.508: U$3.43 97.06,31.24 99.29,31.24 99.67,31.62 101.71,31.62 102.06,31.98 102.06,32.2 C116.1
N$142
  Top 0.508: C117.1 98.18,34.44 97.06,34.44 U$3.47
N$143
  Top 0.508: C118.1 98.38,37.66 98.38,37.44 97.03,36.09 U$3.48
N$144
  Top 0.508: U$3.64 81.5,38.73 C103.2
N$145
  Top 0.508: U$3.3 79.47,33.61 79.44,33.59 78.32,33.59 78.02,33.88 78.02,34.23 77.71,34.54 C104.2 77.06,35.07 C119.2
N$146
  Top 0.508: C119.1 75.95,33.51 76.94,33.51 77.62,32.82 79.76,32.82 79.77,32.81 U$3.4
N$147
  Top 0.508: U$3.9 77.84,28.81 77.53,28.51 74.09,28.51 C120.1
N$148
  Top 0.508: C121.1 77.61,22.99 78.12,23.49 78.08,23.49 79.36,24.78 80.74,24.78 U$3.14
N$149
  Top 0.508: C122.1 84.45,18.62 84.47,18.63 84.47,21.05 U$3.19
N$150
  Top 0.508: U$3.23 87.7,19.69 88.3,19.08 88.3,16.82 C123.1 C134.1
N$151
  Top 0.508: C124.1 93.34,19.39 93.33,19.4 93.33,21.05 U$3.30
N$152
  Top 0.508: C125.1 98.49,24.81 U$3.35
N$153
  Top 0.508: C126.1 103.1,28.84 97.06,28.84 U$3.40
N$154
  Top 0.508: C127.1 99.92,34.02 98.73,32.84 97.06,32.84 U$3.45
N$155
  Top 0.508: U$3.50 94.1,38.91 94.43,39.24 94.43,40.99 94.36,41.06 C128.1
N$156
  Top 0.508: U$3.52 92.5,39.91 C129.1
N$157
  Top 0.508: U$3.55 90.1,39.04 C130.1
N$158
  Top 0.508: U$3.59 86.93,37.37 86.93,39.38 87.5,39.95 C131.1
N$159
  Top 0.508: U$3.62 84.47,37.37 84.47,38.9 83.57,39.8 C132.1
N$160
  Top 0.508: C133.1 82.61,39.93 82.61,39.68 83.7,38.59 U$3.63
N$161
  Top 0.508: U$3.5 80.74,31.98 76.75,31.98 C105.2
N$162
  Top 0.508: U$3.8 77.56,29.61 77.22,29.27 76.04,29.27 75.19,30.12 C106.2 74.91,30.61 73.29,30.61 C120.2
N$163
  Top 0.508: U$3.10 78.19,28.01 77.61,27.43 C107.2
N$164
  Top 0.508: U$3.13 80.74,25.58 79.05,25.58 78.04,24.57 77.17,24.57 76.25,23.65 76.25,23.43 C121.2 75.04,23.75 C108.2
N$165
  Top 0.508: U$3.15 80.74,23.98 79.75,23.98 78.47,22.7 C109.2
N$166
  Top 0.508: U$3.18 83.7,18.94 82.87,18.11 82.87,17.62 82.58,17.32 | 82.58,17.32 82.36,17.32 C110.2 | 82.58,17.32 84.01,17.32 C122.2
N$167
  Top 0.508: U$3.31 94.1,19.71 95.73,18.08 95.95,18.08 C111.2 95.89,17.13 C124.2
N$168
  Top 0.508: C112.2 98.89,21.4 98.89,23.15 98.06,23.98 97.85,23.98 97.06,23.98 U$3.34
N$169
  Top 0.508: U$3.36 100.43,25.61 101.75,24.29 | C113.2 102.94,23.54 102.5,23.54 101.75,24.29 | C125.2 101.74,24.27 101.75,24.29
N$170
  Top 0.508: C114.2 103.2,26.73 103.2,26.95 102.14,28.01 U$3.39
N$171
  Top 0.508: U$3.41 102.38,29.61 103.38,29.61 104.09,30.33 104.09,30.55 C115.2 104.54,28.7 C126.2
N$172
  Top 0.508: C116.2 100.71,32.64 100.33,33.02 99.99,33.02 99.01,32.04 97.06,32.04 U$3.44
N$173
  Top 0.508: C117.2 101.87,35.69 C127.2 100.14,35.32 98.46,33.64 97.06,33.64 U$3.46
N$174
  Top 0.508: C118.2 96.76,37.34 U$3.49
N$175
  Top 0.508: C129.2 93.15,40.98 93.37,40.98 93.67,40.68 93.67,39.56 93.3,39.19 U$3.51
N$176
  Top 0.508: C130.2 89.98,40.47 90.2,40.47 90.9,39.76 U$3.54
N$177
  Top 0.508: C131.2 87.95,41.48 88.16,41.48 88.46,41.18 88.46,39.83 87.7,39.07 U$3.58
N$178
  Top 0.508: C132.2 84.01,41.1 84.23,41.1 85.3,40.03 U$3.61
N$179
  Top 0.508: C104.1 79.64,34.54 79.75,34.44 80.74,34.44 U$3.2
N$183
  Bottom 0.203: C82.2 112.07,13.32 IC2.30
N$211
  Top 0.508: 18.76,84.07 18.76,88.5 18.53,88.73 18.24,88.73 17.65,89.32 R89.2 16.76,90.3 D25.2 | 18.76,84.07 18.76,82.3 20.05,81.01 20.07,81.03 21.6,79.49 | D17.2 21.34,71.37 D18.1 21.76,71.79 21.26,71.79 20.82,72.24 20.82,78.83 21.28,79.3 21.41,79.3 21.6,79.49 | R65.1 21.6,79.49 | C42.1 18.76,84.07
N$212
  Top 0.508: 42.89,85.34 42.89,89.77 42.66,90 42.37,90 41.78,90.59 R125.2 40.89,91.57 D47.2 | 42.89,85.34 42.89,83.57 44.18,82.28 44.2,82.3 45.73,80.76 | D39.2 45.47,72.64 D40.1 45.89,73.06 45.39,73.06 44.95,73.51 44.95,80.1 45.41,80.57 45.54,80.57 45.73,80.76 | R115.1 45.73,80.76 | C48.1 42.89,85.34
N$213
  Top 0.508: 69.56,85.34 69.56,89.77 69.33,90 69.04,90 68.45,90.59 R107.2 67.56,91.57 D36.2 | 69.56,85.34 69.56,83.57 70.85,82.28 70.87,82.3 72.4,80.76 | D28.2 72.14,72.64 D29.1 72.56,73.06 72.06,73.06 71.62,73.51 71.62,80.1 72.08,80.57 72.21,80.57 72.4,80.76 | R97.1 72.4,80.76 | C45.1 69.56,85.34
N$214
  Top 0.508: 97.5,87.88 97.5,92.31 97.27,92.54 96.98,92.54 96.39,93.13 R161.2 95.5,94.11 D69.2 | 97.5,87.88 97.5,86.11 98.79,84.82 98.81,84.84 100.34,83.3 | D61.2 100.08,75.18 D62.1 100.5,75.6 100,75.6 99.56,76.05 99.56,82.64 100.02,83.11 100.15,83.11 100.34,83.3 | R151.1 100.34,83.3 | C54.1 97.5,87.88
NEG_A1_COMP1
  Top 0.508: D18.2 D16.1 24.51,76.33 OPAMP1_COMP1.2 24.05,78.76 24.05,79.45 23.71,79.79 23.02,79.79 22.3,80.52 22.22,80.59 22.22,82.95 C42.2 21.1,82.53 R63.2
NEG_A1_COMP2
  Top 0.508: D40.2 D38.1 48.64,77.6 OPAMP1_COMP3.2 48.18,80.03 48.18,80.72 47.84,81.06 47.15,81.06 46.42,81.79 46.35,81.86 46.35,84.22 C48.2 45.23,83.8 R113.2
NEG_A1_COMP3
  Top 0.508: D29.2 D27.1 75.31,77.6 OPAMP1_COMP2.2 74.85,80.03 74.85,80.72 74.51,81.06 73.82,81.06 73.09,81.79 73.02,81.86 73.02,84.22 C45.2 71.9,83.8 R95.2
NEG_A1_COMP4
  Top 0.508: D62.2 D60.1 103.25,80.14 OPAMP1_COMP5.2 102.79,82.57 102.79,83.26 102.45,83.6 101.76,83.6 101.03,84.33 100.96,84.4 100.96,86.76 C54.2 99.84,86.34 R149.2
NEG_A2_COMP1
  Top 0.508: OPAMP2_COMP1.2 22.94,104.27 22.94,106.99 R75.1 R67.2
NEG_A2_COMP2
  Top 0.508: OPAMP2_COMP3.2 47.07,105.54 47.07,108.26 R118.1 R117.2
NEG_A2_COMP3
  Top 0.508: OPAMP2_COMP2.2 73.74,105.54 73.74,108.26 R100.1 R99.2
NEG_A2_COMP4
  Top 0.508: OPAMP2_COMP5.2 101.68,108.08 101.68,110.8 R154.1 R153.2
NEG_A3_COMP1
  Top 0.508: OPAMP3_COMP1.2 22.05,89.52 22.05,88.83 22.47,88.42 22.54,88.49 24.6,88.49 24.87,88.76 R77.1 26.58,88.47 26.81,88.47 27.76,87.52 27.76,81.51 28,81.27 28.78,81.27 29.87,80.18 29.87,71.12 30.66,70.33 31.53,70.33 32.61,69.25 32.61,60.39 29.37,57.15 28.62,57.15 28.09,56.62 26.89,56.62 21.42,62.09 19.08,62.09 18.4,62.77 18.4,63.73 19.08,64.4 19.81,64.4 21.04,65.64 21.04,66.59 20.32,67.31 20.18,67.31 20.04,67.17 19.08,67.17 18.1,68.15 18.1,87.3 R78.2
NEG_A3_COMP2
  Top 0.508: OPAMP3_COMP3.2 46.18,90.79 46.18,90.1 46.6,89.69 46.67,89.76 48.73,89.76 49,90.03 R120.1 50.71,89.74 50.94,89.74 51.89,88.79 51.89,82.78 52.13,82.54 52.91,82.54 54,81.45 54,72.39 54.79,71.6 55.66,71.6 56.74,70.52 56.74,61.66 53.5,58.42 52.75,58.42 52.22,57.89 51.02,57.89 45.55,63.36 43.21,63.36 42.53,64.04 42.53,65 43.21,65.67 43.94,65.67 45.17,66.91 45.17,67.86 44.45,68.58 44.31,68.58 44.17,68.44 43.21,68.44 42.23,69.42 42.23,88.57 R121.2
NEG_A3_COMP3
  Top 0.508: OPAMP3_COMP2.2 72.85,90.79 72.85,90.1 73.27,89.69 73.34,89.76 75.4,89.76 75.67,90.03 R102.1 77.38,89.74 77.61,89.74 78.56,88.79 78.56,82.78 78.8,82.54 79.58,82.54 80.67,81.45 80.67,72.39 81.46,71.6 82.33,71.6 83.41,70.52 83.41,61.66 80.17,58.42 79.42,58.42 78.89,57.89 77.69,57.89 72.22,63.36 69.88,63.36 69.2,64.04 69.2,65 69.88,65.67 70.61,65.67 71.84,66.91 71.84,67.86 71.12,68.58 70.98,68.58 70.84,68.44 69.88,68.44 68.9,69.42 68.9,88.57 R103.2
NEG_A3_COMP4